# Altium project gtrack_tag_v2.PrjPcb (part 1 of 2)
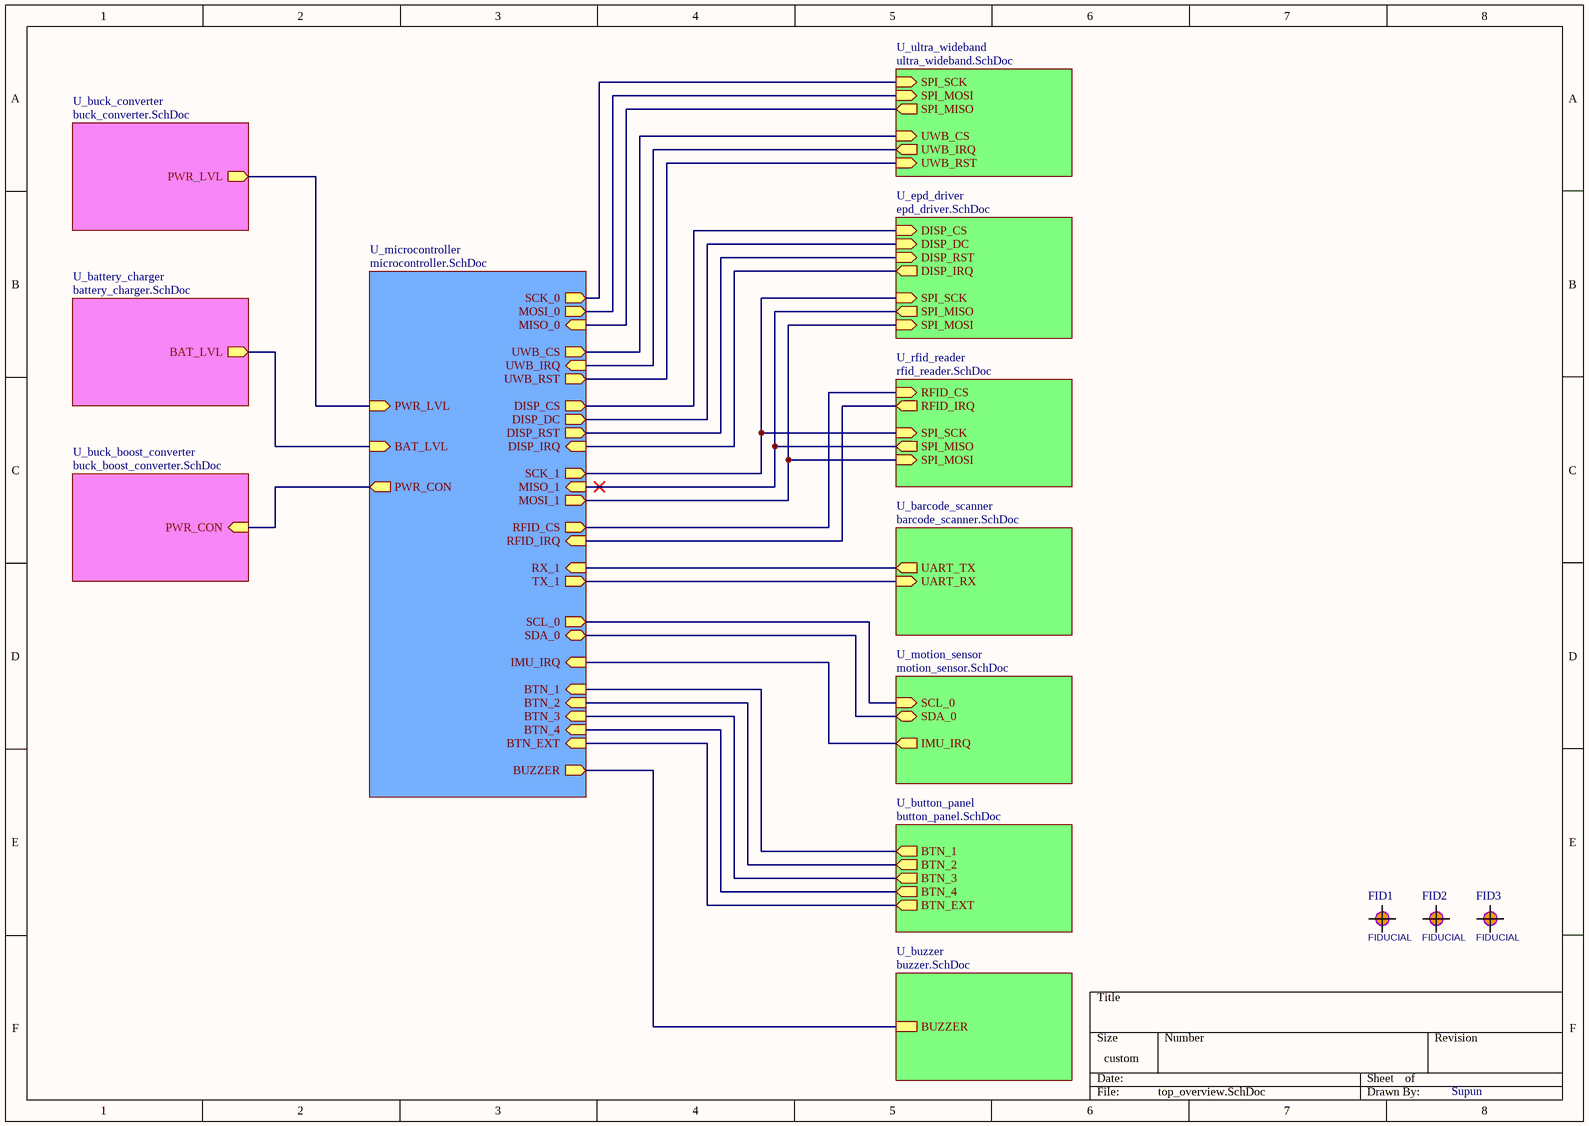
[diagram p0: top_overview.SchDoc]
12 sheets, 250 parts. Net scope: hierarchical (ports join the sheet entries above them; power ports are global).
Board file: GTrackTag_v2.PcbDoc
Sheets:
  top_overview.SchDoc
    U_battery_charger = battery_charger.SchDoc
    U_buck_boost_converter = buck_boost_converter.SchDoc
    U_microcontroller = microcontroller.SchDoc
    U_rfid_reader = rfid_reader.SchDoc
    U_ultra_wideband = ultra_wideband.SchDoc
    U_button_panel = button_panel.SchDoc
    U_barcode_scanner = barcode_scanner.SchDoc
    U_buzzer = buzzer.SchDoc
    U_epd_driver = epd_driver.SchDoc
    U_buck_converter = buck_converter.SchDoc
    U_motion_sensor = motion_sensor.SchDoc

## Sheet top_overview.SchDoc
size 297 x 209 mm; DrawnBy: Supun; Engineer: Supun; Organization: C3

### Parts
FID1  FIDUCIAL  [FIDUCIAL1SM2]  (no BOM)
FID2  FIDUCIAL  [FIDUCIAL1SM2]  (no BOM)
FID3  FIDUCIAL  [FIDUCIAL1SM2]  (no BOM)

### Sub-sheets
U_barcode_scanner = barcode_scanner.SchDoc: UART_TX (out), UART_RX (in)
U_battery_charger = battery_charger.SchDoc: BAT_LVL (out)
U_buck_boost_converter = buck_boost_converter.SchDoc: PWR_CON (in)
U_buck_converter = buck_converter.SchDoc: PWR_LVL (out)
U_button_panel = button_panel.SchDoc: BTN_EXT (out), BTN_2 (out), BTN_4 (out), BTN_1 (out), BTN_3 (out)
U_buzzer = buzzer.SchDoc: BUZZER
U_epd_driver = epd_driver.SchDoc: SPI_MISO (out), DISP_CS (in), DISP_DC (in), SPI_SCK (in), SPI_MOSI (in), DISP_IRQ (out), DISP_RST (in)
U_microcontroller = microcontroller.SchDoc: RFID_IRQ (in), DISP_DC (out), RFID_CS (out), DISP_CS (out), BUZZER (out), DISP_RST (out), MISO_1 (in), MOSI_1 (out), SCK_1 (out), MOSI_0 (out), UWB_CS (out), SCK_0 (out), UWB_IRQ (in), UWB_RST (out), MISO_0 (in), BTN_2 (in), RX_1 (in), BTN_1 (in), BTN_4 (in), TX_1 (out), BTN_3 (in), BTN_EXT (in), PWR_CON (out), BAT_LVL (in), SDA_0 (bidir), SCL_0 (out), DISP_IRQ (in), IMU_IRQ (in), PWR_LVL (in)
U_motion_sensor = motion_sensor.SchDoc: SCL_0 (in), IMU_IRQ (out), SDA_0 (bidir)
U_rfid_reader = rfid_reader.SchDoc: RFID_IRQ (out), SPI_SCK (in), SPI_MISO (out), RFID_CS (in), SPI_MOSI (in)
U_ultra_wideband = ultra_wideband.SchDoc: SPI_MISO (out), UWB_IRQ (out), UWB_RST (in), UWB_CS (in), SPI_SCK (in), SPI_MOSI (in)

### Nets
BAT_LVL: sheet U_battery_charger/BAT_LVL, sheet U_microcontroller/BAT_LVL
BTN_1: sheet U_microcontroller/BTN_1, sheet U_button_panel/BTN_1
BTN_2: sheet U_microcontroller/BTN_2, sheet U_button_panel/BTN_2
BTN_3: sheet U_microcontroller/BTN_3, sheet U_button_panel/BTN_3
BTN_4: sheet U_microcontroller/BTN_4, sheet U_button_panel/BTN_4
BTN_EXT: sheet U_microcontroller/BTN_EXT, sheet U_button_panel/BTN_EXT
BUZZER: sheet U_microcontroller/BUZZER, sheet U_buzzer/BUZZER
DISP_CS: sheet U_microcontroller/DISP_CS, sheet U_epd_driver/DISP_CS
DISP_DC: sheet U_microcontroller/DISP_DC, sheet U_epd_driver/DISP_DC
DISP_IRQ: sheet U_microcontroller/DISP_IRQ, sheet U_epd_driver/DISP_IRQ
IMU_IRQ: sheet U_microcontroller/IMU_IRQ, sheet U_motion_sensor/IMU_IRQ
MISO_0: sheet U_microcontroller/MISO_0, sheet U_ultra_wideband/SPI_MISO
MISO_1: sheet U_microcontroller/MISO_1, sheet U_rfid_reader/SPI_MISO, sheet U_epd_driver/SPI_MISO
MOSI_0: sheet U_microcontroller/MOSI_0, sheet U_ultra_wideband/SPI_MOSI
MOSI_1: sheet U_microcontroller/MOSI_1, sheet U_rfid_reader/SPI_MOSI, sheet U_epd_driver/SPI_MOSI
PWR_CON: sheet U_buck_boost_converter/PWR_CON, sheet U_microcontroller/PWR_CON
PWR_LVL: sheet U_microcontroller/PWR_LVL, sheet U_buck_converter/PWR_LVL
RFID_CS: sheet U_microcontroller/RFID_CS, sheet U_rfid_reader/RFID_CS
RFID_IRQ: sheet U_microcontroller/RFID_IRQ, sheet U_rfid_reader/RFID_IRQ
RST: sheet U_microcontroller/DISP_RST, sheet U_epd_driver/DISP_RST
RX_1: sheet U_microcontroller/RX_1, sheet U_barcode_scanner/UART_TX
SCK_0: sheet U_microcontroller/SCK_0, sheet U_ultra_wideband/SPI_SCK
SCK_1: sheet U_microcontroller/SCK_1, sheet U_rfid_reader/SPI_SCK, sheet U_epd_driver/SPI_SCK
SCL: sheet U_microcontroller/SCL_0, sheet U_motion_sensor/SCL_0
SDA: sheet U_microcontroller/SDA_0, sheet U_motion_sensor/SDA_0
TX_1: sheet U_microcontroller/TX_1, sheet U_barcode_scanner/UART_RX
UWB_CS: sheet U_microcontroller/UWB_CS, sheet U_ultra_wideband/UWB_CS
UWB_IRQ: sheet U_microcontroller/UWB_IRQ, sheet U_ultra_wideband/UWB_IRQ
UWB_RST: sheet U_microcontroller/UWB_RST, sheet U_ultra_wideband/UWB_RST

### Notes on the sheet
- Title
- Size:
- Date:
- A4
- Number:
- Time:
- Revision:
- Sheet
- of
- File:

### Library data of the parts
FID1-FID3 = Fiducial: FIDUCIAL PCB ASSEMBLY AUTOMATED SMT; MF: SAH; ASSEMBLY: DNP; VALUE: FIDUCIAL

## Sheet battery_charger.SchDoc
size 297 x 209 mm; DrawnBy: Supun; Engineer: Supun; Organization: C3
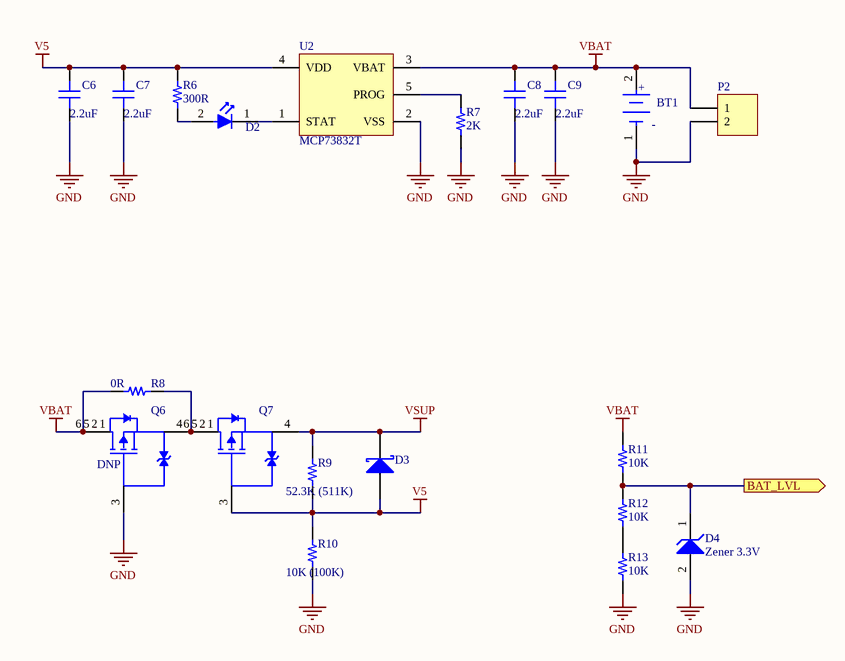
[diagram p1: battery_charger.SchDoc]

### Parts
BT1  18650_battery_holder  [Keystone_1043_0]  (value not drawn)
C6  2.2uF  [CAP 0603_1608]
C7  2.2uF  [CAP 0603_1608]
C8  2.2uF  [CAP 0603_1608]
C9  2.2uF  [CAP 0603_1608]
D2  Red  [Würth_Elektronik_0_MFG]  (value not drawn)
D3  *  [Rohm_TUMD2M_MFG]  (value not drawn)
D4  Zener 3.3V  [Diodes_SOD-123_0]
P2  DNP  [HDR1X2]  (value not drawn)
Q6  DNP  [Diodes_Inc._TSOT26_MFG]
Q7  P Mosfet  [Diodes_Inc._TSOT26_MFG]  (value not drawn)
R6  300R  [RES 0603_1608]
R7  2K  [RES 0603_1608]
R8  0R  [RES 0603_1608]
R9  52.3K (511K)  [RES 0603_1608]
R10  10K (100K)  [RES 0603_1608]
R11  10K  [RES 0603_1608]
R12  10K  [RES 0603_1608]
R13  10K  [RES 0603_1608]
U2  MCP73832T  [MICROCHIP SOT-23-5 OT]

### Ports
BAT_LVL (out)

### Nets
GND: BT1.1(C) C6.2 C7.2 C8.2 C9.2 D4.2(A) P2.2 Q6.3(G) R7.2 R10.2 R13.2 U2.2(VSS)
V5: C6.1 C7.1 D3.2(A) Q7.3(G) R6.2 R9.2 R10.1 U2.4(VDD)
VBAT: BT1.2(A) C8.1 C9.1 P2.1 Q6.1(D) Q6.2(D) Q6.5(D) Q6.6(D) R8.1 R11.1 U2.3(VBAT)
VSUP: D3.1(K) Q7.4(S) R9.1
BAT_LVL: D4.1(K) R11.2 R12.1 ; port BAT_LVL
NetD2_1: D2.1(C) U2.1(STAT)
NetD2_2: D2.2(A) R6.1
NetQ6_4: Q6.4(S) Q7.1(D) Q7.2(D) Q7.5(D) Q7.6(D) R8.2
NetR7_1: R7.1 U2.5(PROG)
NetR12_2: R12.2 R13.1

### Notes on the sheet
- Title
- Size:
- Date:
- A4
- Number:
- Time:
- Revision:
- Sheet
- of
- File:
- (in symbol 18650_battery_holder) +; -

### Library data of the parts
BT1 = 18650_battery_holder: Batt Holder 18650 1 Cell; MF: *; MP: *; Value: *
C6-C9 = Capacitor: SMT Capacitor; MF: Samsung; MP: CL10A225KP8NNNC; Value: 2.2uF; Link: https://www.mouser.com/ProductDetail/Samsung-Electro-Mechanics/CL10A225KP8NNNC?qs=hqM3L16%252Bxldb5UYUGQVB5Q%3D%3D
D2 = LED SMD: Led Diffused SMD; MF: LiteOn; MP: LTST-C190KRKT; Value: Red; Link: https://www.mouser.com/ProductDetail/Lite-On/LTST-C190KRKT?qs=kAD5fFa1n5VY3YYNWPC1Fg%3D%3D
D3 = Schottky Diode: Schottky Barrier Rectifier, 40 V Maximum DC Blocking Voltage, -65 to 125 degC, 2-Pin SMA Case, RoHS; MF: Toshiba; MP: CUHS20F30,H3F; ComponentLink1Description: Manufacturer URL; ComponentLink2Description: Datasheet; ComponentLink3URL: http://www.vishay.com/docs/88746/ss12.pdf; ComponentLink3Description: Package Specification; ComponentLink1URL: http://www.vishay.com/; ComponentLink2URL: http://www.vishay.com/docs/88746/ss12.pdf; Value: *; Link: https://www.mouser.com/ProductDetail/Toshiba/CUHS20F30H3F?qs=PqoDHHvF6497%2FIoWy79A3w%3D%3D
D4 = Zener Diode: Zener Voltage Regulator; Manufacturer: On Semiconductor; Packing: Tape and Reel; P Max (W): 0.5; VZ Typ (V): 4.7; MF: Onsemi; MP: MMSZ5226BT1G; ComponentLink1Description: Manufacturer URL; ComponentLink2Description: Datasheet; DatasheetVersion: Rev. 12; ComponentLink3URL: http://www.onsemi.com/pub_link/Collateral/425-04.PDF; ComponentLink3Description: Package Specification; ComponentLink1URL: http://www.onsemi.com/; ComponentLink2URL: http://www.onsemi.com/pub_link/Collateral/MMSZ5221BT1-D.PDF; PackageVersion: Rev. G, 10/2009; PackageReference: SOD-123-2-425-04; PackageDescription: 2-Pin SOD, Body 1.6 x 2.69 mm; Mounting Technology: Surface Mount; RoHS: Pb-Free; Value: Zener 3.3V; Link: https://www.mouser.com/ProductDetail/onsemi/MMSZ5226BT1G?qs=P4IOph%252Bbot%2Ft8yNxdh48XQ%3D%3D
P2 = Header 2: Header, 2-Pin; LatestRevisionDate: 17-Jul-2002; LatestRevisionNote: Re-released for DXP Platform.; Publisher: Altium Limited; Value: DNP; Link: https://
Q6 = Mosfet-P-6_ESD: P-Channel Enhancement Mode MOS Transistor, 3-Pin SOT23; MF: Vishay; MP: SI3421DV-T1-GE3; Value: P Mosfet; Link: https://www.mouser.com/ProductDetail/Vishay-Semiconductors/SI3421DV-T1-GE3?qs=dpt6vIvaxwjvmZPXyyVpRg%3D%3D
Q7 = Mosfet-P-6_ESD: P-Channel Enhancement Mode MOS Transistor, 3-Pin SOT23; MF: Vishay; MP: SI3421DV-T1-GE3; Value: P Mosfet; Link: https://www.mouser.com/ProductDetail/Vishay-Semiconductors/SI3421DV-T1-GE3?qs=dpt6vIvaxwjvmZPXyyVpRg%3D%3D
R6 = Resistor: SMT Resistor; MF: YAGEO; MP: AC0603FR-07300RL; Value: 300R; Link: https://www.mouser.com/ProductDetail/YAGEO/AC0603FR-07300RL?qs=yhV1fb9g%2FKYRCKndxB9juA%3D%3D
R7 = Resistor: SMT Resistor; MF: YAGEO; MP: AC0603FR-072KL; Value: 2K; Link: https://www.mouser.com/ProductDetail/YAGEO/AC0603FR-072KL?qs=ygRr%2FtkhtesLR2bjSRHyag%3D%3D
R8 = Resistor: SMT Resistor; MF: YAGEO; MP: AC0603FR-070RL; Value: 0R; Link: https://www.mouser.com/ProductDetail/YAGEO/AC0603FR-070RL?qs=UoPT7wUmgYIHE8YhvUntLg%3D%3D
R9 = Resistor: SMT Resistor; MF: YAGEO; MP: AC0603FR-0752K3L; Value: 52.3K; Link: https://www.mouser.com/ProductDetail/YAGEO/AC0603FR-0752K3L?qs=ygRr%2Ftkhtes52vQmIU4puQ%3D%3D
R10-R13 = Resistor: SMT Resistor; MF: YAGEO; MP: AC0603FR-0710KL; Value: 10K; Link: https://www.mouser.com/ProductDetail/YAGEO/AC0603FR-0710KL?qs=UoPT7wUmgYKz3zh0UDMA4Q%3D%3D
U2 = MCP73832T: Miniature Single-Cell, Fully Integrated Li-Ion, Li-Polymer Charge Management Controller, 4.2V, 5-Pin SOT-23, Industrial Temperature, Tape and Reel; PartNumber: MCP73832T-2DCI/OT; MF: Microchip; PackageDescription: 5-Lead Plastic Small Outline Transistor (OT) [SOT-23]; PackageVersion: revBB, Aug-2009; DatasheetVersion: revE, Sep-2008; Code_IPC: SOT23-5; PackageReference: SOT-23-OT5; MP: MCP73832T-2DCI/OT; Value: *; Link: https://www.mouser.com/ProductDetail/Microchip-Technology/MCP73832T-2DCI-OT?qs=yUQqVecv4quyMtCX903Btw%3D%3D

## Sheet buck_boost_converter.SchDoc
size 297 x 209 mm; DrawnBy: Supun; Engineer: Supun; Organization: C3
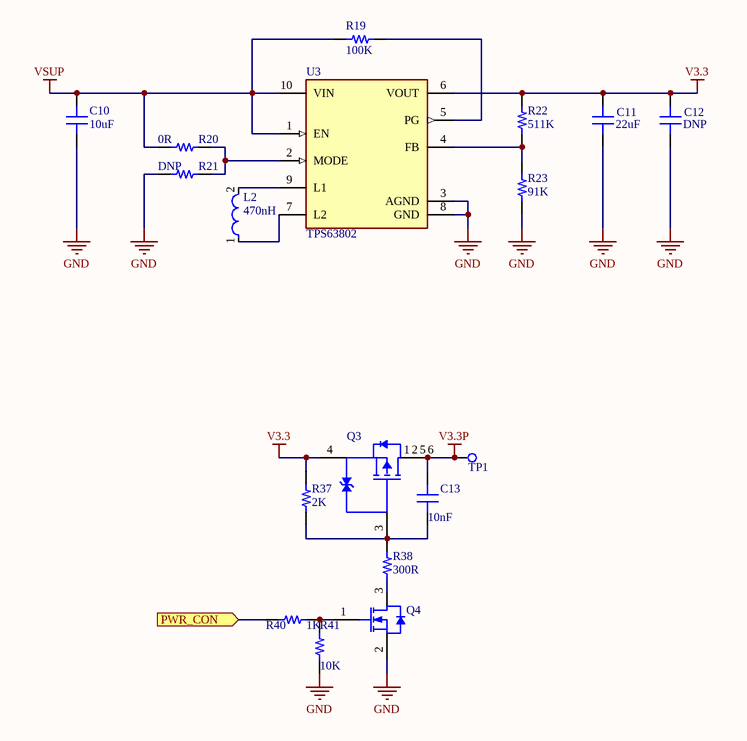
[diagram p2: buck_boost_converter.SchDoc]

### Parts
C10  10uF  [CAP 0603_1608]
C11  22uF  [CAP 0603_1608]
C12  DNP  [CAP 0603_1608]
C13  10nF  [CAP 0603_1608]
L2  470nH  [Coilcraft_XFL4015_MFG]
Q3  P Mosfet  [Diodes_Inc._TSOT26_MFG]  (value not drawn)
Q4  N Mosfet  [ON SEMI SOT-23-3]  (value not drawn)
R19  100K  [RES 0603_1608]
R20  0R  [RES 0603_1608]
R21  DNP  [RES 0603_1608]
R22  511K  [RES 0603_1608]
R23  91K  [RES 0603_1608]
R37  2K  [RES 0603_1608]
R38  300R  [RES 0603_1608]
R40  1K  [RES 0603_1608]
R41  10K  [RES 0603_1608]
TP1  Test Point  [TPSMD_S1]  (value not drawn)
U3  TPS63802  [Texas_Instruments_DLA0010A_MFG]

### Ports
PWR_CON (in)

### Nets
GND: C10.2 C11.2 C12.2 Q4.2(S) R21.1 R23.2 R41.1 U3.3(AGND) U3.8(GND)
V3.3: C11.1 C12.1 Q3.4(S) R22.1 R37.1 U3.6(VOUT)
V3.3P: C13.1 Q3.1(D) Q3.2(D) Q3.5(D) Q3.6(D) TP1.1(TP)
VSUP: C10.1 R19.1 R20.1 U3.1(EN) U3.10(VIN)
PWR_CON: R40.1 ; port PWR_CON
NetC13_2: C13.2 Q3.3(G) R37.2 R38.2
NetL2_1: L2.1 U3.7(L2)
NetL2_2: L2.2 U3.9(L1)
NetQ4_1: Q4.1(G) R40.2 R41.2
NetQ4_3: Q4.3(D) R38.1
NetR19_2: R19.2 U3.5(PG)
NetR20_2: R20.2 R21.2 U3.2(MODE)
NetR22_2: R22.2 R23.1 U3.4(FB)

### Notes on the sheet
- Title
- Size:
- Date:
- A4
- Number:
- Time:
- Revision:
- Sheet
- of
- File:

### Library data of the parts
C10 = Capacitor: SMT Capacitor; MF: Murata; MP: GRM188R61C106MAALD; Value: 10uF; Link: https://www.mouser.com/ProductDetail/Murata-Electronics/GRM188R61C106MAALD?qs=hNud%2FORuBR3LEOKZ4RJp9w%3D%3D
C11 C12 = Capacitor: SMT Capacitor; MF: Murata; MP: GRM188R61A226ME15D; Link: https://www.mouser.com/ProductDetail/Murata-Electronics/GRM188R61A226ME15D?qs=eeBpzGFlv%252B8DV%2FrilzyhAw%3D%3D
  C11: Value: 22uF
  C12: Value: DNP
C13 = Capacitor: SMT Capacitor; MF: Murata; MP: GRM1885C1E103JA01D; Value: 10nF; Link: https://www.mouser.com/ProductDetail/Murata-Electronics/GRM1885C1E103JA01D?qs=ui%252B2d9lVEI4mHR%2FJ9wCzmw%3D%3D
L2 = Inductor_sm: Fixed Inductors 2.2uH 20% High Temp AEC-Q200; MF: Coilcraft; MP: XFL4015-471MEC; Value: 470nH; Link: https://www.mouser.com/ProductDetail/Coilcraft/XFL4015-471MEC?qs=zCSbvcPd3pYzCOJSVbeMnw%3D%3D
Q3 = Mosfet-P-6_ESD: as Q7 on sheet battery_charger; Value: P Mosfet; Link: https://www.mouser.com/ProductDetail/Vishay-Semiconductors/SI3421DV-T1-GE3?qs=dpt6vIvaxwjvmZPXyyVpRg%3D%3D
Q4 = Mosfet-N: N-Channel Enhancement Mode MOS Transistor, 30 V, 0.85 A, 3-Pin SOT23, Tape and Reel; Coss [typ] (pF): 27; Ciss [typ] (pF): 83; Packing: Tape & Reel; ID [max] (A): 0.85; VDS [max] (V): 30; MF: Diodes; MP: DMN2053U-7; ComponentLink1Description: Manufacturer URL; ComponentLink2Description: Datasheet; ComponentLink3Description: Package Specification; ComponentLink3URL: http://www.nxp.com/documents/outline_drawing/sot023_po.pdf; ComponentLink1URL: http://www.nxp.com/; ComponentLink2URL: http://www.nxp.com/documents/data_sheet/BSH103.pdf; PackageReference: SOT23; Channel Type: N; Code_JEDEC: TO-236AB; Mounting Technology: Surface Mount; PackageDescription: 3-Pin Small Outline Transistor Package, Body 2.9 x 1.3 mm, Pitch 0.95 mm; PackageVersion: 06-03-16, 03/2006; Value: N Mosfet; Link: https://www.mouser.com/ProductDetail/Diodes-Incorporated/DMN2053U-7?qs=y6ZabgHbY%252BwZqQYPRB57iA%3D%3D
R19 = Resistor: SMT Resistor; MF: YAGEO; MP: AC0603FR-07100KL; Value: 100K; Link: https://www.mouser.com/ProductDetail/YAGEO/AC0603FR-07100KL?qs=UoPT7wUmgYKBKZ83mTH%252BSA%3D%3D
R20 R21 = Resistor: as R8 on sheet battery_charger; Link: https://www.mouser.com/ProductDetail/YAGEO/AC0603FR-070RL?qs=UoPT7wUmgYIHE8YhvUntLg%3D%3D
  R20: Value: 0R
  R21: Value: DNP
R22 = Resistor: SMT Resistor; MF: YAGEO; MP: AC0603FR-07511KL; Value: 511K; Link: https://www.mouser.com/ProductDetail/YAGEO/AC0603FR-07511KL?qs=sGAEpiMZZMvdGkrng054twVr7TWeaA0slq%2FUVYWFkhk%3D
R23 = Resistor: SMT Resistor; MF: YAGEO; MP: AC0603FR-0791KL; Value: 91K; Link: https://www.mouser.com/ProductDetail/YAGEO/AC0603FR-0791KL?qs=sGAEpiMZZMvdGkrng054t2uy2SOblyUPa6Z36%252BTPeHc%3D
R37 = Resistor: as R7 on sheet battery_charger; Value: 2K; Link: https://www.mouser.com/ProductDetail/YAGEO/AC0603FR-072KL?qs=ygRr%2FtkhtesLR2bjSRHyag%3D%3D
R38 = Resistor: as R6 on sheet battery_charger; Value: 300R; Link: https://www.mouser.com/ProductDetail/YAGEO/AC0603FR-07300RL?qs=yhV1fb9g%2FKYRCKndxB9juA%3D%3D
R40 = Resistor: SMT Resistor; MF: YAGEO; MP: AC0603FR-071KL; Value: 1K; Link: https://www.mouser.com/ProductDetail/YAGEO/AC0603FR-071KL?qs=UoPT7wUmgYJx4gI0q%252BcIRQ%3D%3D
R41 = Resistor: as R10 on sheet battery_charger; Value: 10K; Link: https://www.mouser.com/ProductDetail/YAGEO/AC0603FR-0710KL?qs=UoPT7wUmgYKz3zh0UDMA4Q%3D%3D
U3 = TPS63802: Switching Voltage Regulators 2-A, high-efficient, 11- uA quiescent current buck-boost converter in QFN/DFN package 10-VSON-HR -40 to 125; MF: Texas Instruments; MP: TPS63802DLAT; Value: *; Link: https://www.mouser.com/ProductDetail/Texas-Instruments/TPS63802DLAT?qs=9r4v7xj2LnmaSyyQsA%2FrUA%3D%3D
TP1 = Test Point: Link: https://

## Sheet microcontroller.SchDoc
size 297 x 209 mm; DrawnBy: Supun; Engineer: Supun; Organization: C3
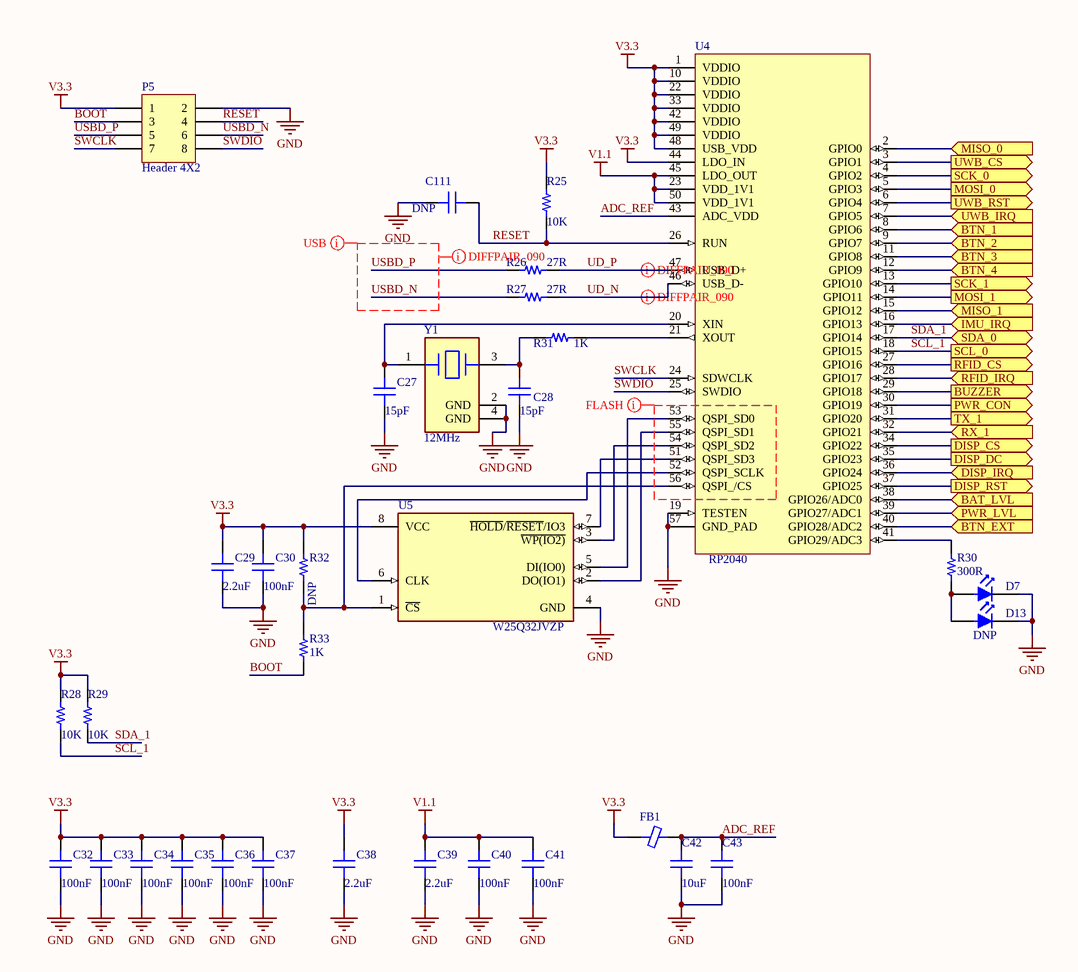
[diagram p3: microcontroller.SchDoc]

### Parts
C27  15pF  [CAP 0603_1608]
C28  15pF  [CAP 0603_1608]
C29  2.2uF  [CAP 0603_1608]
C30  100nF  [CAP 0603_1608]
C32  100nF  [CAP 0603_1608]
C33  100nF  [CAP 0603_1608]
C34  100nF  [CAP 0603_1608]
C35  100nF  [CAP 0603_1608]
C36  100nF  [CAP 0603_1608]
C37  100nF  [CAP 0603_1608]
C38  2.2uF  [CAP 0603_1608]
C39  2.2uF  [CAP 0603_1608]
C40  100nF  [CAP 0603_1608]
C41  100nF  [CAP 0603_1608]
C42  10uF  [CAP 0603_1608]
C43  100nF  [CAP 0603_1608]
C111  DNP  [CAP 0603_1608]
D7  Green  [Würth_Elektronik_0_MFG]  (value not drawn)
D13  DNP  [Würth_Elektronik_0_MFG]
FB1  Ferrite Beads  [Murata_BLM18-0_15-t0_8_MFG]  (value not drawn)
P5  Header 4X2  [HDR2X4]
R25  10K  [RES 0603_1608]
R26  27R  [RES 0603_1608]
R27  27R  [RES 0603_1608]
R28  10K  [RES 0603_1608]
R29  10K  [RES 0603_1608]
R30  300R  [RES 0603_1608]
R31  1K  [RES 0603_1608]
R32  DNP  [RES 0603_1608]
R33  1K  [RES 0603_1608]
U4  RP2040  [RP2040-Footprint-1]
U5  W25Q32JVZP  [WINBOND WSON-8 6x5mm]
Y1  12MHz  [ABRACON ABM8G]

### Ports
BAT_LVL (in), BTN_1 (in), BTN_2 (in), BTN_3 (in), BTN_4 (in), BTN_EXT (in), BUZZER (out), DISP_CS (out), DISP_DC (out), DISP_IRQ (in), DISP_RST (out), IMU_IRQ (in), MISO_0 (in), MISO_1 (in), MOSI_0 (out), MOSI_1 (out), PWR_CON (out), PWR_LVL (in), RFID_CS (out), RFID_IRQ (in), RX_1 (in), SCK_0 (out), SCK_1 (out), SCL_0 (out), SDA_0 (bidir), TX_1 (out), UWB_CS (out), UWB_IRQ (in), UWB_RST (out)

### Nets
GND: C27.1 C28.1 C29.2 C30.2 C32.2 C33.2 C34.2 C35.2 C36.2 C37.2 C38.2 C39.2 C40.2 C41.2 C42.2 C43.2 C111.1 D7.1(C) D13.1(C) P5.2 U4.19(TESTEN) U4.57(GND_PAD) U5.4(GND) Y1.2(GND) Y1.4(GND)
V1.1: C39.1 C40.1 C41.1 U4.23(VDD_1V1) U4.45(LDO_OUT) U4.50(VDD_1V1)
V3.3: C29.1 C30.1 C32.1 C33.1 C34.1 C35.1 C36.1 C37.1 C38.1 FB1.1 P5.1 R25.2 R28.2 R29.2 R32.1 U4.1(VDDIO) U4.10(VDDIO) U4.22(VDDIO) U4.33(VDDIO) U4.42(VDDIO) U4.44(LDO_IN) U4.48(USB_VDD) U4.49(VDDIO) U5.8(VCC)
ADC_REF: C42.1 C43.1 FB1.2 U4.43(ADC_VDD)
BAT_LVL: U4.38(GPIO26/ADC0) ; port BAT_LVL
BOOT: P5.3 R33.1
BTN_1: U4.8(GPIO6) ; port BTN_1
BTN_2: U4.9(GPIO7) ; port BTN_2
BTN_3: U4.11(GPIO8) ; port BTN_3
BTN_4: U4.12(GPIO9) ; port BTN_4
BTN_EXT: U4.40(GPIO28/ADC2) ; port BTN_EXT
BUZZER: U4.29(GPIO18) ; port BUZZER
DISP_CS: U4.34(GPIO22) ; port DISP_CS
DISP_DC: U4.35(GPIO23) ; port DISP_DC
DISP_IRQ: U4.36(GPIO24) ; port DISP_IRQ
IMU_IRQ: U4.16(GPIO13) ; port IMU_IRQ
MISO_0: U4.2(GPIO0) ; port MISO_0
MISO_1: U4.15(GPIO12) ; port MISO_1
MOSI_0: U4.5(GPIO3) ; port MOSI_0
MOSI_1: U4.14(GPIO11) ; port MOSI_1
PWR_CON: U4.30(GPIO19) ; port PWR_CON
PWR_LVL: U4.39(GPIO27/ADC1) ; port PWR_LVL
RESET: C111.2 P5.4 R25.1 U4.26(RUN)
RFID_CS: U4.27(GPIO16) ; port RFID_CS
RFID_IRQ: U4.28(GPIO17) ; port RFID_IRQ
RST: U4.37(GPIO25) ; port DISP_RST
RX_1: U4.32(GPIO21) ; port RX_1
SCK_0: U4.4(GPIO2) ; port SCK_0
SCK_1: U4.13(GPIO10) ; port SCK_1
SCL_1: R28.1 U4.18(GPIO15) ; port SCL_0  [project net SCL]
SDA_1: R29.1 U4.17(GPIO14) ; port SDA_0  [project net SDA]
SWCLK: P5.7 U4.24(SDWCLK)
SWDIO: P5.8 U4.25(SWDIO)
TX_1: U4.31(GPIO20) ; port TX_1
UD_N: R27.2 U4.46(USB_D-)
UD_P: R26.2 U4.47(USB_D+)
USBD_N: P5.6 R27.1
USBD_P: P5.5 R26.1
UWB_CS: U4.3(GPIO1) ; port UWB_CS
UWB_IRQ: U4.7(GPIO5) ; port UWB_IRQ
UWB_RST: U4.6(GPIO4) ; port UWB_RST
NetC27_2: C27.2 U4.20(XIN) Y1.1
NetC28_2: C28.2 R31.1 Y1.3
NetD7_2: D7.2(A) D13.2(A) R30.2
NetR30_1: R30.1 U4.41(GPIO29/ADC3)
NetR31_2: R31.2 U4.21(XOUT)
NetR32_2: R32.2 R33.2 U4.56(QSPI_/CS) U5.1(~{CS})
NetU4_51: U4.51(QSPI_SD3) U5.7(~{HOLD}/~{RESET}/IO3)
NetU4_52: U4.52(QSPI_SCLK) U5.6(CLK)
NetU4_53: U4.53(QSPI_SD0) U5.5(DI(IO0))
NetU4_54: U4.54(QSPI_SD2) U5.3(~{WP(IO2)})
NetU4_55: U4.55(QSPI_SD1) U5.2(DO(IO1))

### Layout directives
differential pair; differential pair class DIFF090: UD_N, UD_P, USBD_N, USBD_P
net class FLASH: (no net found under the mark)
net class USB: USBD_N, USBD_P

### Notes on the sheet
- Title
- Size:
- Date:
- A4
- Number:
- Time:
- Revision:
- Sheet
- of
- File:

### Library data of the parts
C27 C28 = Capacitor: SMT Capacitor; MF: Murata; MP: GRM1885C1H150JA01J; Value: 15pF; Link: https://www.mouser.com/ProductDetail/Murata-Electronics/GRM1885C1H150JA01J?qs=6X6%252BjuxzJaBd4%252Bvb3bD5Gw%3D%3D
C29 C38 C39 = Capacitor: as C6 on sheet battery_charger; Value: 2.2uF; Link: https://www.mouser.com/ProductDetail/Samsung-Electro-Mechanics/CL10A225KP8NNNC?qs=hqM3L16%252Bxldb5UYUGQVB5Q%3D%3D
C30 C32-C37 C40 C41 C43 = Capacitor: SMT Capacitor; MF: TDK; MP: CGA3E2X7R1E104K080AA; Value: 100nF; Link: https://www.mouser.com/ProductDetail/TDK/CGA3E2X7R1E104K080AA?qs=NRhsANhppD%2Fm7%2FOmmsm0vg%3D%3D
C42 = Capacitor: as C10 on sheet buck_boost_converter; Value: 10uF; Link: https://www.mouser.com/ProductDetail/Murata-Electronics/GRM188R61C106MAALD?qs=hNud%2FORuBR3LEOKZ4RJp9w%3D%3D
C111 = Capacitor: SMT Capacitor; MP: C0603C104K4PACTU; Value: DNP; Link: https://
D7 D13 = LED SMD: Led Diffused SMD; MF: LiteOn; MP: LTST-C190KGKT; Link: https://www.mouser.com/ProductDetail/Lite-On/LTST-C190KGKT?qs=205qCy6M2Q%252BAdcgwUZktqw%3D%3D
  D7: Value: Green
  D13: Value: DNP
FB1 = Ferrite Chip: SMT Ferrite Chip; MF: Murata; MP: BLM18PG471SN1D; Link: https://www.mouser.com/ProductDetail/Murata-Electronics/BLM18PG471SN1D?qs=EYzdjubb4S%2FN1Ip39GrHyg%3D%3D
P5 = Header 4X2: Header, 4-Pin, Dual row; LatestRevisionDate: 17-Jul-2002; LatestRevisionNote: Re-released for DXP Platform.; Publisher: Altium Limited
R25 R28 R29 = Resistor: as R10 on sheet battery_charger; Value: 10K; Link: https://www.mouser.com/ProductDetail/YAGEO/AC0603FR-0710KL?qs=UoPT7wUmgYKz3zh0UDMA4Q%3D%3D
R26 R27 = Resistor: SMT Resistor; MF: YAGEO; MP: AC0603FR-0727RL; Value: 27R; Link: https://www.mouser.com/ProductDetail/YAGEO/AC0603FR-0727RL?qs=yhV1fb9g%2FKZSwVP2Wqwqfg%3D%3D
R30 = Resistor: as R6 on sheet battery_charger; Value: 300R; Link: https://www.mouser.com/ProductDetail/YAGEO/AC0603FR-07300RL?qs=yhV1fb9g%2FKYRCKndxB9juA%3D%3D
R31 R33 = Resistor: as R40 on sheet buck_boost_converter; Value: 1K; Link: https://www.mouser.com/ProductDetail/YAGEO/AC0603FR-071KL?qs=UoPT7wUmgYJx4gI0q%252BcIRQ%3D%3D
R32 = Resistor: SMT Resistor; MF: *; MP: *; Value: DNP; Link: https://
U4 = RP2040: ARM® Cortex®-M0+ series Microcontroller IC 32-Bit Dual-Core 133MHz 16MB (16M x 8) FLASH 56-QFN (7x7); MF: Raspberry Pi; MP: RP2040TR13; Link: https://www.digikey.com/en/products/detail/raspberry-pi/SC0914-13/14306010
U5 = W25Q32JVZP: 3V 32M-BIT SERIAL FLASH MEMORY WITH DUAL, QUAD SPI; MF: Winbond; MP: W25Q32JVZPIQ; Value: *; Link: https://www.mouser.com/ProductDetail/Winbond/W25Q32JVZPIQ?qs=qSfuJ%252Bfl%2Fd5Ca0jgzBVqQA%3D%3D
Y1 = Crystal: Crystals AEC-Q200 CRYSTAL 4pin SMD; MF: ECS; MP: ECS-120-12-33-AGN-TR; Value: 12MHz; Link: https://www.mouser.com/ProductDetail/ECS/ECS-120-12-33-AGN-TR?qs=wd5RIQLrsJj7GY%252BaXCrd3A%3D%3D

## Sheet rfid_reader.SchDoc
size 297 x 209 mm; DrawnBy: Supun; Engineer: Supun; Organization: C3
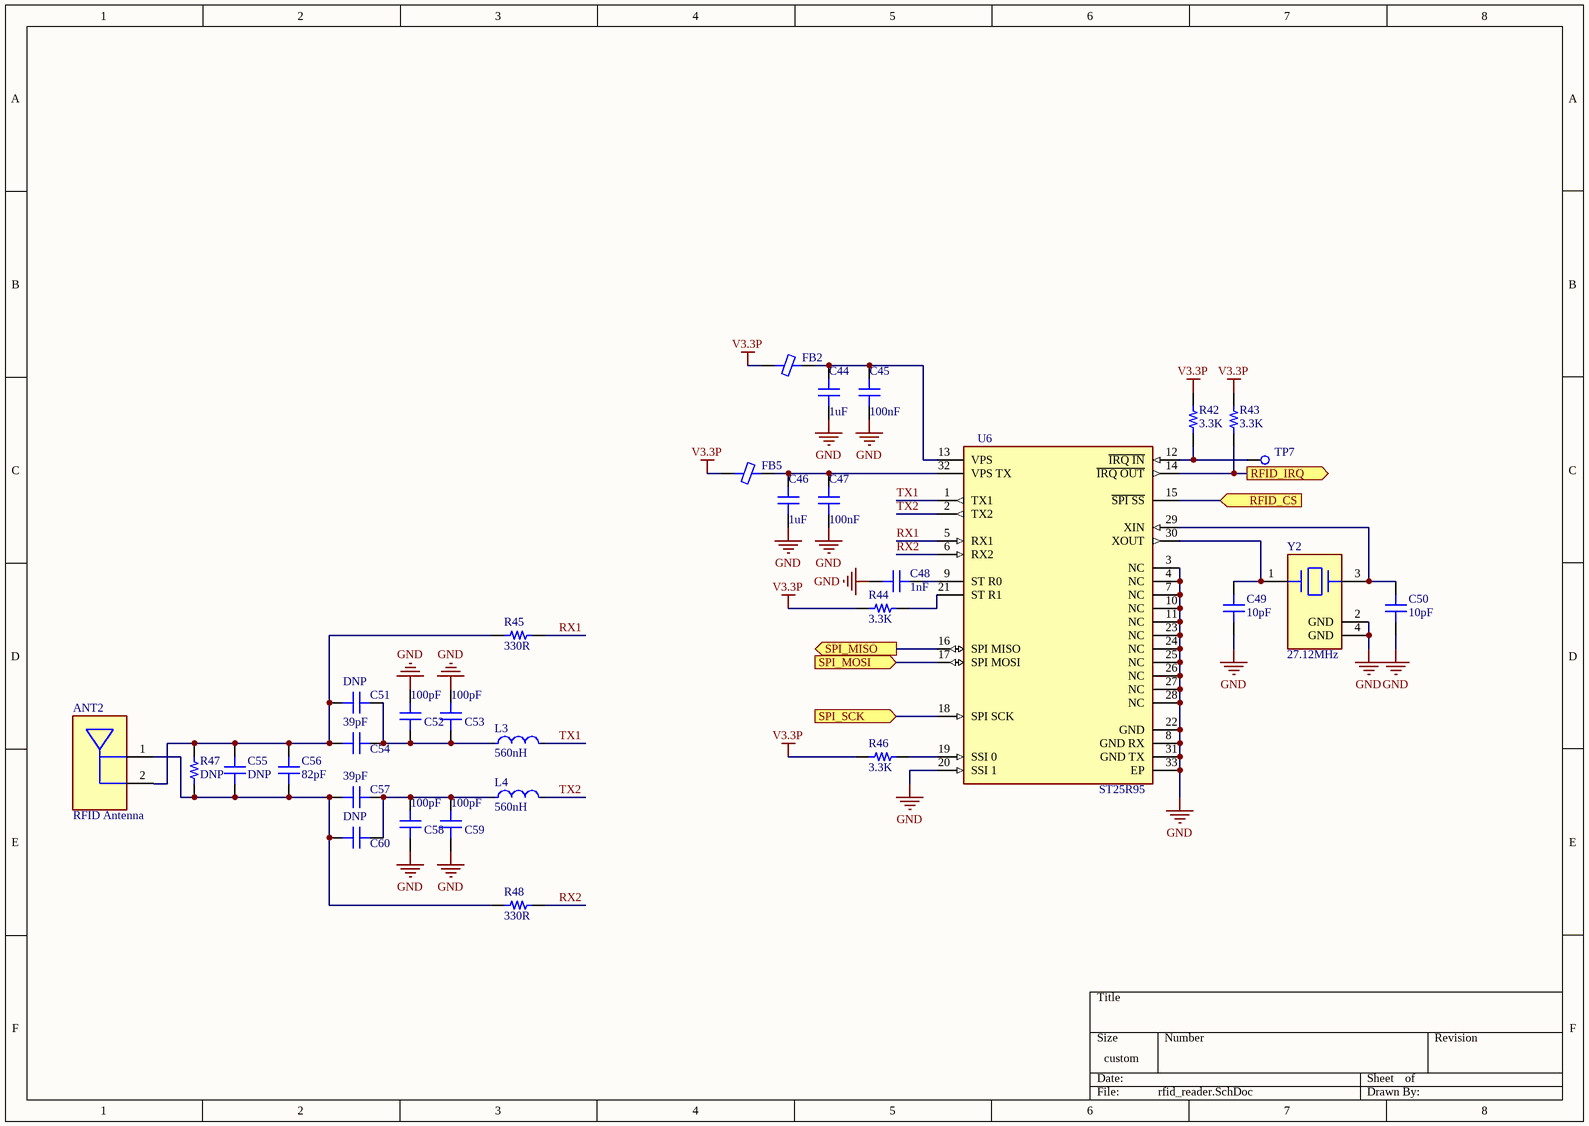
[diagram p4: rfid_reader.SchDoc]

### Parts
ANT2  RFID Antenna  [RFID_Antenna_3]
C44  1uF  [CAP 0603_1608]
C45  100nF  [CAP 0603_1608]
C46  1uF  [CAP 0603_1608]
C47  100nF  [CAP 0603_1608]
C48  1nF  [CAP 0603_1608]
C49  10pF  [CAP 0603_1608]
C50  10pF  [CAP 0603_1608]
C51  DNP  [CAP 0603_1608]
C52  100pF  [CAP 0603_1608]
C53  100pF  [CAP 0603_1608]
C54  39pF  [CAP 0603_1608]
C55  DNP  [CAP 0603_1608]
C56  82pF  [CAP 0603_1608]
C57  39pF  [CAP 0603_1608]
C58  100pF  [CAP 0603_1608]
C59  100pF  [CAP 0603_1608]
C60  DNP  [CAP 0603_1608]
FB2  (no value)  [Murata_BLM18-0_15-t0_8_MFG]
FB5  (no value)  [Murata_BLM18-0_15-t0_8_MFG]
L3  560nH  [IND 0806_2016]
L4  560nH  [IND 0806_2016]
R42  3.3K  [RES 0603_1608]
R43  3.3K  [RES 0603_1608]
R44  3.3K  [RES 0603_1608]
R45  330R  [RES 0603_1608]
R46  3.3K  [RES 0603_1608]
R47  DNP  [RES 0603_1608]
R48  330R  [RES 0603_1608]
TP7  Test Point  [TPSMD_S1]  (value not drawn)
U6  ST25R95  [STMicroelectronics_0_MFG]
Y2  27.12MHz  [ABRACON ABM8G]

### Ports
RFID_CS (in), RFID_IRQ (out), SPI_MISO (out), SPI_MOSI (in), SPI_SCK (in)

### Nets
GND: C44.1 C45.2 C46.1 C47.2 C48.1 C49.2 C50.2 C52.2 C53.2 C58.1 C59.1 U6.3(NC) U6.4(NC) U6.7(NC) U6.8(GND_RX) U6.10(NC) U6.11(NC) U6.20(SSI_1) U6.22(GND) U6.23(NC) U6.24(NC) U6.25(NC) U6.26(NC) U6.27(NC) U6.28(NC) U6.31(GND_TX) U6.33(EP) Y2.2(GND) Y2.4(GND)
V3.3P: FB2.1 FB5.1 R42.2 R43.2 R44.2 R46.2
MISO_1: U6.16(SPI_MISO) ; port SPI_MISO
MOSI_1: U6.17(SPI_MOSI) ; port SPI_MOSI
RFID_CS: U6.15(~{SPI_SS}) ; port RFID_CS
RFID_IRQ: R43.1 U6.14(~{IRQ_OUT}) ; port RFID_IRQ
RX1: R45.2 U6.5(RX1)
RX2: R48.2 U6.6(RX2)
SCK_1: U6.18(SPI_SCK) ; port SPI_SCK
TX1: L3.2 U6.1(TX1)
TX2: L4.2 U6.2(TX2)
NetANT2_1: ANT2.1 C55.1 C56.1 C57.2 C60.2 R47.1 R48.1
NetANT2_2: ANT2.2 C51.2 C54.2 C55.2 C56.2 R45.1 R47.2
NetC44_2: C44.2 C45.1 FB2.2 U6.13(VPS)
NetC46_2: C46.2 C47.1 FB5.2 U6.32(VPS_TX)
NetC48_2: C48.2 U6.9(ST_R0)
NetC49_1: C49.1 U6.30(XOUT) Y2.1
NetC50_1: C50.1 U6.29(XIN) Y2.3
NetC51_1: C51.1 C52.1 C53.1 C54.1 L3.1
NetC57_1: C57.1 C58.2 C59.2 C60.1 L4.1
NetR42_1: R42.1 TP7.1(TP) U6.12(~{IRQ_IN})
NetR44_1: R44.1 U6.21(ST_R1)
NetR46_1: R46.1 U6.19(SSI_0)

### Notes on the sheet
- Title
- Size:
- Date:
- A4
- Number:
- Time:
- Revision:
- Sheet
- of
- File:

### Library data of the parts
ANT2 = RFID PCB Antenna_2: 13.56MHz RFID Antenna 926.04 nH; MF: SAH; MP: *; Value: *
C44 C46 = Capacitor: SMT Capacitor; MF: Murata; MP: GRT188R61H105KE13D; Value: 1uF; Link: https://www.mouser.com/ProductDetail/Murata-Electronics/GRT188R61H105KE13D?qs=drgMNd%252BkGPNIxxtJByMGCg%3D%3D
C45 C47 = Capacitor: as C30 on sheet microcontroller; Value: 100nF; Link: https://www.mouser.com/ProductDetail/TDK/CGA3E2X7R1E104K080AA?qs=NRhsANhppD%2Fm7%2FOmmsm0vg%3D%3D
C48 = Capacitor: SMT Capacitor; MF: Murata; MP: GRM1885C1H102JA01D; Value: 1nF; Link: https://www.mouser.com/ProductDetail/Murata-Electronics/GRM1885C1H102JA01D?qs=H3lwsW1hsDtu9zD8AnV%2FOA%3D%3D
C49 C50 = Capacitor: SMT Capacitor; MF: Murata; MP: GRM1885C1H100GA01D; Value: 10pF; Link: https://www.mouser.com/ProductDetail/Murata-Electronics/GRM1885C1H100GA01D?qs=7Aw3Ng%2FBaE5snYvHxKANnw%3D%3D
C51 C54 C57 C60 = Capacitor: SMT Capacitor; MF: Murata; MP: GRM1885C1H390GA01J
  C51 C60: Value: DNP; Link: https://
  C54 C57: Value: 39pF; Link: https://www.mouser.com/ProductDetail/Murata-Electronics/GRM1885C1H390GA01J?qs=e4YKHiQKHyeNmbmJ2lwXdA%3D%3D
C52 C53 C58 C59 = Capacitor: SMT Capacitor; MF: Murata; MP: GRM1885C1H101GA01D; Value: 100pF; Link: https://www.mouser.com/ProductDetail/Murata-Electronics/GRM1885C1H101GA01D?qs=EsFwWZAkQ9fH40WPOVe8Rw%3D%3D
C55 = Capacitor: SMT Capacitor; MF: Murata; MP: GRM1885C1H560JA01J; Value: DNP; Link: https://
C56 = Capacitor: SMT Capacitor; MF: Murata; MP: GRM1885C1H820GA01D; Value: 82pF; Link: https://www.mouser.com/ProductDetail/Murata-Electronics/GRM1885C1H820GA01D?qs=wKgLNriqil4ECu1Lcc209g%3D%3D
FB2 FB5 = Ferrite Chip: SMT Ferrite Chip; MF: Murata Electronics; MP: BLM18RK601SN1D; Link: https://www.mouser.com/ProductDetail/Murata-Electronics/BLM18RK601SN1D?qs=y0QmqViQyZ9CJKFf5yPaOw%3D%3D
L3 L4 = Inductor_sm: Fixed Inductors 2.2uH 20% High Temp AEC-Q200; MF: Murata; MP: LQM21NNR56K10D; Value: 560nH; Link: https://www.mouser.com/ProductDetail/Murata-Electronics/LQM21NNR56K10D?qs=da47FVKfWTYye7WAouSyDQ%3D%3D
R42-R44 R46 = Resistor: SMT Resistor; MF: YAGEO; MP: AC0603FR-073K3L; Value: 3.3K; Link: https://www.mouser.com/ProductDetail/YAGEO/AC0603FR-073K3L?qs=yhV1fb9g%2FKZasQ4U0IUUCA%3D%3D
R45 R48 = Resistor: SMT Resistor; MF: YAGEO; MP: AC0603FR-07330RL; Value: 330R; Link: https://www.mouser.com/ProductDetail/YAGEO/AC0603FR-07330RL?qs=yhV1fb9g%2FKZrF%252BndswOPKw%3D%3D
R47 = Resistor: SMT Resistor; MF: Vishay; MP: CRCW06035R62FKEA; Value: DNP; Link: https://
U6 = ST25R95-VMD5T: RFID/NFC 13.56-MHz multi-protocol contactless transceiver IC; MF: STMicroelectronics; MP: ST25R95-VMD5T; Value: *; Link: https://www.mouser.com/ProductDetail/STMicroelectronics/ST25R95-VMD5T?qs=l7cgNqFNU1hwf5BC2e1e3A%3D%3D
Y2 = Crystal: Crystals AEC-Q200 CRYSTAL 4pin SMD; MF: ABRACON; MP: ABM8-27.120MHZ-10-D1G-T; Value: 27.12MHz; Link: https://www.mouser.com/ProductDetail/ABRACON/ABM8-27.120MHZ-10-D1G-T?qs=wnTfsH77Xs6%2FgBbo4S6Gaw%3D%3D
TP7 = Test Point: Link: https://

## Sheet ultra_wideband.SchDoc
size 297 x 209 mm; DrawnBy: Supun; Engineer: Supun; Organization: C3
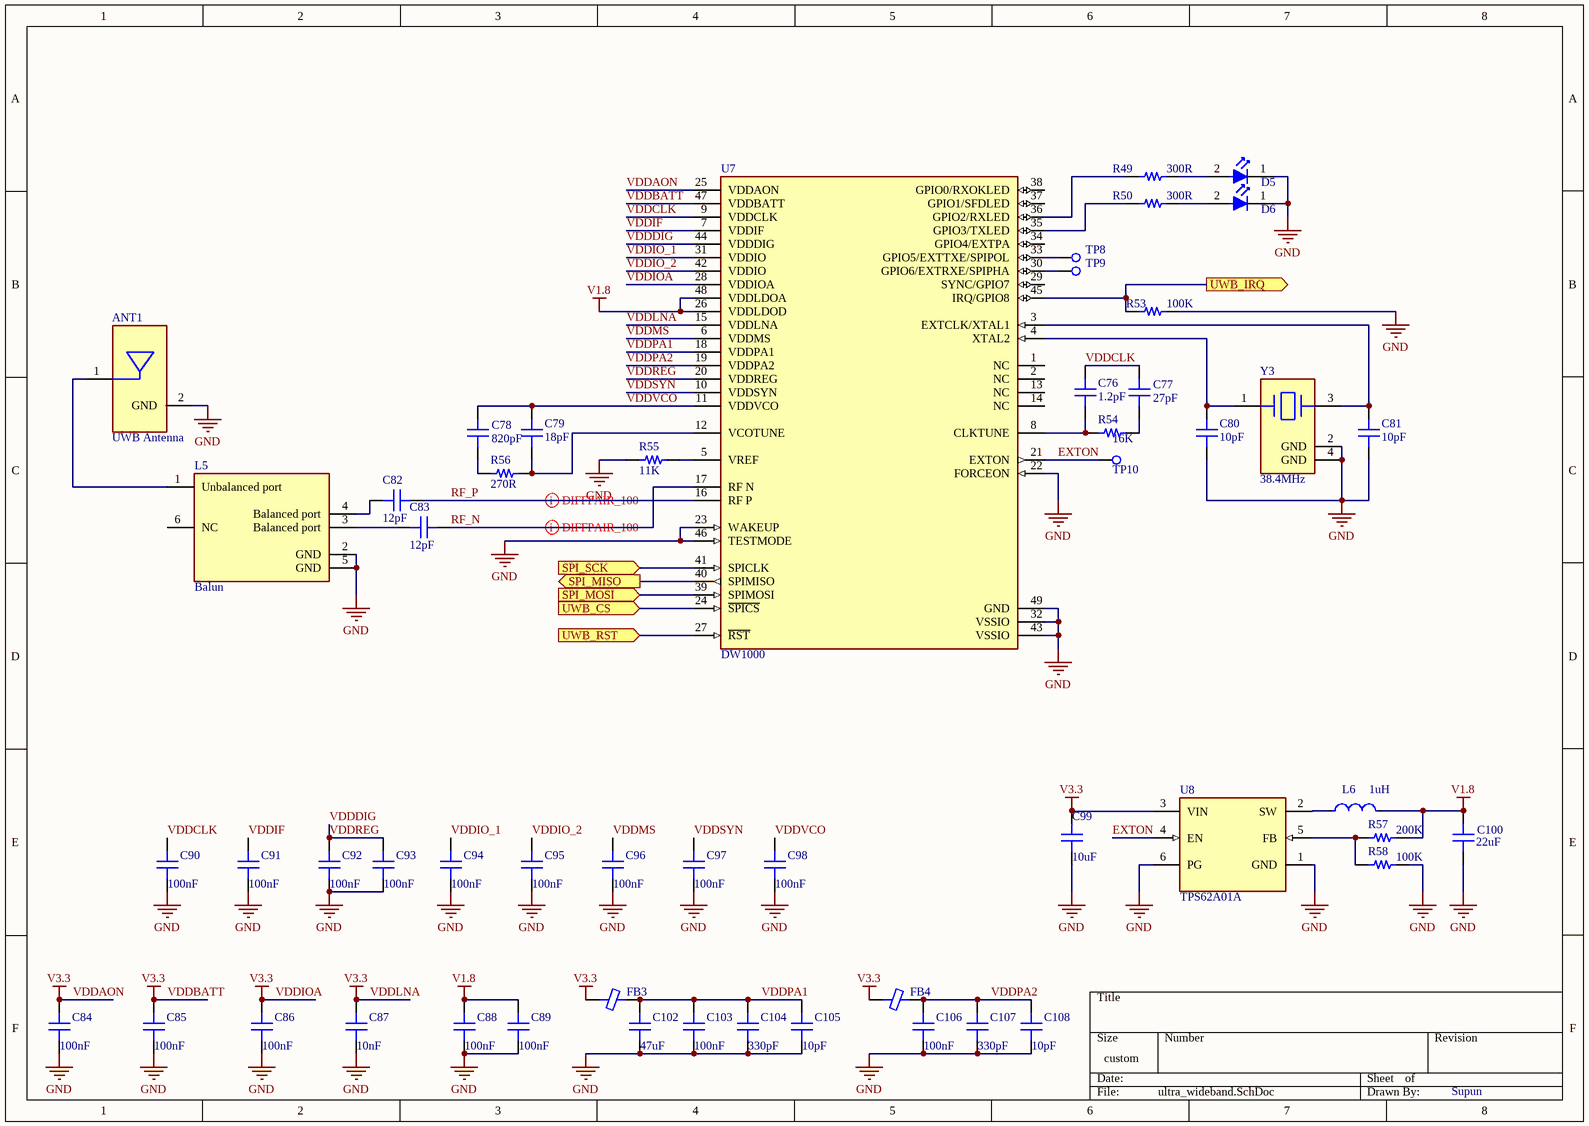
[diagram p5: ultra_wideband.SchDoc]

### Parts
ANT1  UWB Antenna  [UWB_ANTENNA_2]
C76  1.2pF  [CAP 0603_1608]
C77  27pF  [CAP 0603_1608]
C78  820pF  [CAP 0603_1608]
C79  18pF  [CAP 0603_1608]
C80  10pF  [CAP 0603_1608]
C81  10pF  [CAP 0603_1608]
C82  12pF  [CAP 0603_1608]
C83  12pF  [CAP 0603_1608]
C84  100nF  [CAP 0603_1608]
C85  100nF  [CAP 0603_1608]
C86  100nF  [CAP 0603_1608]
C87  10nF  [CAP 0603_1608]
C88  100nF  [CAP 0603_1608]
C89  100nF  [CAP 0603_1608]
C90  100nF  [CAP 0603_1608]
C91  100nF  [CAP 0603_1608]
C92  100nF  [CAP 0603_1608]
C93  100nF  [CAP 0603_1608]
C94  100nF  [CAP 0603_1608]
C95  100nF  [CAP 0603_1608]
C96  100nF  [CAP 0603_1608]
C97  100nF  [CAP 0603_1608]
C98  100nF  [CAP 0603_1608]
C99  10uF  [CAP 0603_1608]
C100  22uF  [CAP 0603_1608]
C102  47uF  [CAP 0603_1608]
C103  100nF  [CAP 0603_1608]
C104  330pF  [CAP 0603_1608]
C105  10pF  [CAP 0603_1608]
C106  100nF  [CAP 0603_1608]
C107  330pF  [CAP 0603_1608]
C108  10pF  [CAP 0603_1608]
D5  Green  [Würth_Elektronik_0_MFG]  (value not drawn)
D6  Red  [Würth_Elektronik_0_MFG]  (value not drawn)
FB3  Ferrite Beads  [Murata_BLM18-0_15-t0_8_MFG]  (value not drawn)
FB4  Ferrite Beads  [Murata_BLM18-0_15-t0_8_MFG]  (value not drawn)
L5  Balun  [TDK_HHM1595A1_MFG]
L6  1uH  [IND 1008_2520]
R49  300R  [RES 0603_1608]
R50  300R  [RES 0603_1608]
R53  100K  [RES 0603_1608]
R54  16K  [RES 0603_1608]
R55  11K  [RES 0603_1608]
R56  270R  [RES 0603_1608]
R57  200K  [RES 0603_1608]
R58  100K  [RES 0603_1608]
TP8  Test Point  [TPSMD_S1]  (value not drawn)
TP9  Test Point  [TPSMD_S1]  (value not drawn)
TP10  Test Point  [TPSMD_S1]  (value not drawn)
U7  DW1000  [Qorvo_1_IPC_B]
U8  TPS62A01A  [TI SOT-563 DRL]
Y3  38.4MHz  [ABRACON ABM8G]

### Ports
SPI_MISO (out), SPI_MOSI (in), SPI_SCK (in), UWB_CS (in), UWB_IRQ (out), UWB_RST (in)

### Nets
GND: ANT1.2(GND) C80.1 C81.1 C84.2 C85.2 C86.2 C87.2 C88.2 C89.2 C90.2 C91.2 C92.2 C93.2 C94.2 C95.2 C96.2 C97.2 C98.2 C99.2 C100.2 C102.1 C103.2 C104.1 C105.1 C106.2 C107.1 C108.1 D5.1(C) D6.1(C) L5.2(GND) L5.5(GND) R53.1 R55.1 R58.2 U7.22(FORCEON) U7.23(WAKEUP) U7.32(VSSIO) U7.43(VSSIO) U7.46(TESTMODE) U7.49(GND) U8.1(GND) U8.6(PG) Y3.2(GND) Y3.4(GND)
V1.8: C88.1 C89.1 C100.1 L6.2 R57.2 U7.26(VDDLDOD) U7.48(VDDLDOA)
V3.3: C84.1 C85.1 C86.1 C87.1 C99.1 FB3.1 FB4.1 U7.15(VDDLNA) U7.25(VDDAON) U7.28(VDDIOA) U7.47(VDDBATT) U8.3(VIN)  [also labelled VDDAON, VDDBATT, VDDIOA, VDDLNA]
EXTON: TP10.1(TP) U7.21(EXTON) U8.4(EN)
MISO_0: U7.40(SPIMISO) ; port SPI_MISO
MOSI_0: U7.39(SPIMOSI) ; port SPI_MOSI
RF_N: C83.1 U7.17(RF_N)
RF_P: C82.1 U7.16(RF_P)
SCK_0: U7.41(SPICLK) ; port SPI_SCK
UWB_CS: U7.24(~{SPICS}) ; port UWB_CS
UWB_IRQ: R53.2 U7.45(IRQ/GPIO8) ; port UWB_IRQ
UWB_RST: U7.27(~{RST}) ; port UWB_RST
VDDCLK: C76.2 C77.2 C90.1 U7.9(VDDCLK)
VDDDIG: C92.1 C93.1 U7.20(VDDREG) U7.44(VDDDIG)  [also labelled VDDREG]
VDDIF: C91.1 U7.7(VDDIF)
VDDIO_1: C94.1 U7.31(VDDIO)
VDDIO_2: C95.1 U7.42(VDDIO)
VDDMS: C96.1 U7.6(VDDMS)
VDDPA1: C102.2 C103.1 C104.2 C105.2 FB3.2 U7.18(VDDPA1)
VDDPA2: C106.1 C107.2 C108.2 FB4.2 U7.19(VDDPA2)
VDDSYN: C97.1 U7.10(VDDSYN)
VDDVCO: C78.2 C79.2 C98.1 U7.11(VDDVCO)
NetANT1_1: ANT1.1 L5.1(Unbalanced_port)
NetC76_1: C76.1 R54.2 U7.8(CLKTUNE)
NetC77_1: C77.1 R54.1
NetC78_1: C78.1 R56.2
NetC79_1: C79.1 R56.1 U7.12(VCOTUNE)
NetC80_2: C80.2 U7.4(XTAL2) Y3.1
NetC81_2: C81.2 U7.3(EXTCLK/XTAL1) Y3.3
NetC82_2: C82.2 L5.4(Balanced_port)
NetC83_2: C83.2 L5.3(Balanced_port)
NetD5_2: D5.2(A) R49.2
NetD6_2: D6.2(A) R50.2
NetL6_1: L6.1 U8.2(SW)
NetR49_1: R49.1 U7.36(GPIO2/RXLED)
NetR50_1: R50.1 U7.35(GPIO3/TXLED)
NetR55_2: R55.2 U7.5(VREF)
NetR57_1: R57.1 R58.1 U8.5(FB)
NetTP8_1: TP8.1(TP) U7.33(GPIO5/EXTTXE/SPIPOL)
NetTP9_1: TP9.1(TP) U7.30(GPIO6/EXTRXE/SPIPHA)

Not connected (* = marked no-connect by the designer): L5 6(NC); U7 1(NC) 2(NC) 13(NC) 14(NC) 29(SYNC/GPIO7) 34(GPIO4/EXTPA) 37(GPIO1/SFDLED) 38(GPIO0/RXOKLED)

### Layout directives
differential pair; differential pair class DIFF100: RF_N, RF_P

### Notes on the sheet
- Title
- Size:
- Date:
- A4
- Number:
- Time:
- Revision:
- Sheet
- of
- File:

### Library data of the parts
ANT1 = UWB PCB Antenna: PCB Antenna; MF: SAH; MP: *; Value: *
C76 = Capacitor: SMT Capacitor; MF: Murata; MP: GRM1885C1H1R2CA01D; Value: 1.2pF; Link: https://www.mouser.com/ProductDetail/Murata-Electronics/GRM1885C1H1R2CA01D?qs=9yYqngZLNofO2BzK0fMtoQ%3D%3D
C77 = Capacitor: SMT Capacitor; MF: Murata; MP: GRM1885C1H270JA01D; Value: 27pF; Link: https://www.mouser.com/ProductDetail/Murata-Electronics/GRM1885C1H270JA01D?qs=Mti35kkwCSM3XwxonqPhaQ%3D%3D
C78 = Capacitor: SMT Capacitor; MF: Murata; MP: GRM1885C1H821JA01D; Value: 820pF; Link: https://www.mouser.com/ProductDetail/Murata-Electronics/GRM1885C1H821JA01D?qs=2MiASeLb%252BOD2kFngltnvvA%3D%3D
C79 = Capacitor: SMT Capacitor; MF: Murata; MP: GRM1885C1H180JA01J; Value: 18pF; Link: https://www.mouser.com/ProductDetail/Murata-Electronics/GRM1885C1H180JA01J?qs=9Cj2FLRihcNL8A7ng%252BzQpQ%3D%3D
C80 C81 C105 C108 = Capacitor: as C49 on sheet rfid_reader; Value: 10pF
  C80 C81: Link: https://www.mouser.com/ProductDetail/Murata-Electronics/GRM1885C1H100GA01D?qs=7Aw3Ng%2FBaE5snYvHxKANnw%3D%3D
  C105 C108: Link: https://
C82 C83 = Capacitor: SMT Capacitor; MF: Murata; MP: GRM1885C1H120JA01J; Value: 12pF; Link: https://www.mouser.com/ProductDetail/Murata-Electronics/GRM1885C1H120JA01J?qs=6X6%252BjuxzJaDbS6LwzBiDtw%3D%3D
C84-C86 C88-C98 C103 C106 = Capacitor: as C30 on sheet microcontroller; Value: 100nF; Link: https://www.mouser.com/ProductDetail/TDK/CGA3E2X7R1E104K080AA?qs=NRhsANhppD%2Fm7%2FOmmsm0vg%3D%3D
C87 = Capacitor: as C13 on sheet buck_boost_converter; Value: 10nF; Link: https://www.mouser.com/ProductDetail/Murata-Electronics/GRM1885C1E103JA01D?qs=ui%252B2d9lVEI4mHR%2FJ9wCzmw%3D%3D
C99 = Capacitor: as C10 on sheet buck_boost_converter; Value: 10uF; Link: https://www.mouser.com/ProductDetail/Murata-Electronics/GRM188R61C106MAALD?qs=hNud%2FORuBR3LEOKZ4RJp9w%3D%3D
C100 = Capacitor: as C11 on sheet buck_boost_converter; Value: 22uF; Link: https://www.mouser.com/ProductDetail/Murata-Electronics/GRM188R61A226ME15D?qs=eeBpzGFlv%252B8DV%2FrilzyhAw%3D%3D
C102 = Capacitor: SMT Capacitor; MF: Murata; MP: GRM188R60J476ME15D; Value: 47uF; Link: https://www.mouser.com/ProductDetail/Murata-Electronics/GRM188R60J476ME15D?qs=AEetWsPH0It1A1GvJsMuyQ%3D%3D
C104 C107 = Capacitor: SMT Capacitor; MF: Murata; MP: GRM1885C1H331JA01D; Value: 330pF; Link: https://www.mouser.com/ProductDetail/Murata-Electronics/GRM1885C1H331JA01D?qs=DiwnqUvG%2FIUYCCwNVhuo3w%3D%3D
D5 = LED SMD: as D7 on sheet microcontroller; Value: Green; Link: https://www.mouser.com/ProductDetail/Lite-On/LTST-C190KGKT?qs=205qCy6M2Q%252BAdcgwUZktqw%3D%3D
D6 = LED SMD: as D2 on sheet battery_charger; Value: Red; Link: https://www.mouser.com/ProductDetail/Lite-On/LTST-C190KRKT?qs=kAD5fFa1n5VY3YYNWPC1Fg%3D%3D
FB3 FB4 = Ferrite Chip: SMT Ferrite Chip; MF: Murata; MP: BLM18AG601SH1D; Link: https://www.mouser.com/ProductDetail/Murata-Electronics/BLM18AG601SH1D?qs=L3QzcrVjv97OjVi99nCgnA%3D%3D
L5 = HHM1595A1: Signal Conditioning LTCC BALUN 3000-8000MHz; MF: TDK; MP: HHM1595A1; Value: Balun; Link: https://www.mouser.com/ProductDetail/TDK/HHM1595A1?qs=CQ%2FIPMfstfij2T2%252BDRqDhg%3D%3D
L6 = Inductor_sm: Fixed Inductors 2.2uH 20% High Temp AEC-Q200; MF: Murata; MP: DFE252012F-1R0M=P2; Value: 1uH; Link: https://www.mouser.com/ProductDetail/Murata-Electronics/DFE252012F-1R0M%3dP2?qs=ty6qhqyUUEtPvXJAIo0Pnw%3D%3D
R49 R50 = Resistor: as R6 on sheet battery_charger; Value: 300R; Link: https://www.mouser.com/ProductDetail/YAGEO/AC0603FR-07300RL?qs=yhV1fb9g%2FKYRCKndxB9juA%3D%3D
R53 R58 = Resistor: as R19 on sheet buck_boost_converter; Value: 100K; Link: https://www.mouser.com/ProductDetail/YAGEO/AC0603FR-07100KL?qs=UoPT7wUmgYKBKZ83mTH%252BSA%3D%3D
R54 = Resistor: SMT Resistor; MF: YAGEO; MP: AC0603FR-0716KL; Value: 16K; Link: https://www.mouser.com/ProductDetail/YAGEO/AC0603FR-0716KL?qs=yhV1fb9g%2FKbveWp4BLOPMQ%3D%3D
R55 = Resistor: SMT Resistor; MF: YAGEO; MP: AC0603FR-0711KL; Value: 11K; Link: https://www.mouser.com/ProductDetail/YAGEO/AC0603FR-0711KL?qs=yhV1fb9g%2FKb4ptOMRzX2uQ%3D%3D
R56 = Resistor: SMT Resistor; MF: YAGEO; MP: AC0603FR-07270RL; Value: 270R; Link: https://www.mouser.com/ProductDetail/YAGEO/AC0603FR-07270RL?qs=yhV1fb9g%2FKYFLWtESjiWpg%3D%3D
R57 = Resistor: SMT Resistor; MF: YAGEO; MP: AC0603FR-07200KL; Value: 200K; Link: https://www.mouser.com/ProductDetail/YAGEO/AC0603FR-07200KL?qs=sGAEpiMZZMvdGkrng054t2uy2SOblyUPuZUSlNzrwrw%3D
U7 = DW1000: Fully integrated Ultra Wideband (UWB) transceiver IC, IEEE802.15.4-2011, 2-way ranging or TDoA, up to 6.8 Mbps; MF: Qorvo; MP: DW1000-I-TR13; Parameter 1: *; Link: https://www.mouser.com/ProductDetail/Qorvo/DW1000-I-TR13?qs=TiOZkKH1s2SHqHtNDSAfuQ%3D%3D
U8 = TPS62A01A: Switching Voltage Regulators 2.5-V to 5.5-V input, 1-A high-efficiency step-down converter with forced PWM in SOT-563 package; MF: Texas Instruments; MP: TPS62A01ADRLR; Link: https://www.mouser.com/ProductDetail/Texas-Instruments/TPS62A01ADRLR?qs=tlsG%2FOw5FFjxQ1CGo801Kw%3D%3D
Y3 = Crystal: Crystals AEC-Q200 CRYSTAL 4pin SMD; MF: ECS; MP: ECS-384-10-33B-CKY-TR; Value: 38.4MHz; Link: https://www.mouser.com/ProductDetail/ECS/ECS-384-10-33B-CKY-TR?qs=wd5RIQLrsJh9q4Mm6EsgEw%3D%3D
TP8-TP10 = Test Point: Link: https://

## Sheet button_panel.SchDoc
size 297 x 209 mm; DrawnBy: Supun; Engineer: Supun; Organization: C3
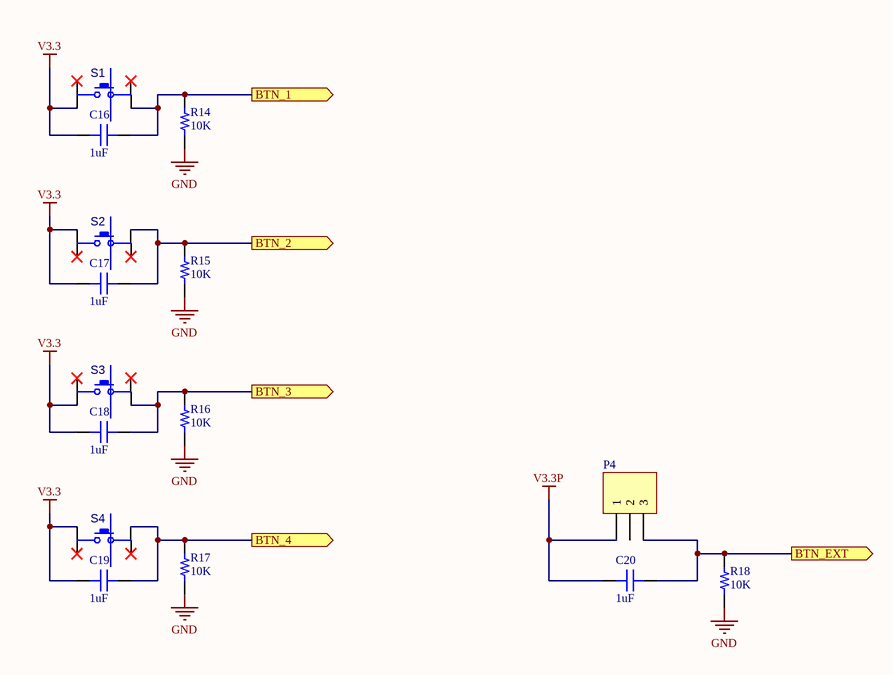
[diagram p6: button_panel.SchDoc]

### Parts
C16  1uF  [CAP 0603_1608]
C17  1uF  [CAP 0603_1608]
C18  1uF  [CAP 0603_1608]
C19  1uF  [CAP 0603_1608]
C20  1uF  [CAP 0603_1608]
P4  (no value)  [TEConn_EP2.5_1x3]
R14  10K  [RES 0603_1608]
R15  10K  [RES 0603_1608]
R16  10K  [RES 0603_1608]
R17  10K  [RES 0603_1608]
R18  10K  [RES 0603_1608]
S1  SPST-NO  [C&K PTS125 H7.3]  (value not drawn)
S2  SPST-NO  [C&K PTS125 H7.3]  (value not drawn)
S3  SPST-NO  [C&K PTS125 H7.3]  (value not drawn)
S4  SPST-NO  [C&K PTS125 H7.3]  (value not drawn)

### Ports
BTN_1 (out), BTN_2 (out), BTN_3 (out), BTN_4 (out), BTN_EXT (out)

### Nets
GND: R14.2 R15.2 R16.2 R17.2 R18.2
V3.3: C16.2 C17.2 C18.2 C19.2 S1.2(P3) S2.1(P1) S3.2(P3) S4.1(P1)
V3.3P: C20.2 P4.1
BTN_1: C16.1 R14.1 S1.4(P2) ; port BTN_1
BTN_2: C17.1 R15.1 S2.3(P4) ; port BTN_2
BTN_3: C18.1 R16.1 S3.4(P2) ; port BTN_3
BTN_4: C19.1 R17.1 S4.3(P4) ; port BTN_4
BTN_EXT: C20.1 P4.3 R18.1 ; port BTN_EXT

Not connected (* = marked no-connect by the designer): P4 2; S1 1(P1)* 3(P4)*; S2 2(P3)* 4(P2)*; S3 1(P1)* 3(P4)*; S4 2(P3)* 4(P2)*

### Notes on the sheet
- Title
- Size:
- Date:
- A4
- Number:
- Time:
- Revision:
- Sheet
- of
- File:

### Library data of the parts
C16-C20 = Capacitor: as C44 on sheet rfid_reader; Value: 1uF; Link: https://www.mouser.com/ProductDetail/Murata-Electronics/GRT188R61H105KE13D?qs=drgMNd%252BkGPNIxxtJByMGCg%3D%3D
P4 = Header 3H: Header, 3-Pin, Right Angle; MF: TE Connectivity; MP: 1744426-3; LatestRevisionDate: 17-Jul-2002; LatestRevisionNote: Re-released for DXP Platform.; Publisher: Altium Limited; Link: https://www.mouser.com/ProductDetail/TE-Connectivity-AMP/1744426-3?qs=IGPQaF7TU6sEhFWrzjofqw%3D%3D
R14-R18 = Resistor: as R10 on sheet battery_charger; Value: 10K; Link: https://www.mouser.com/ProductDetail/YAGEO/AC0603FR-0710KL?qs=UoPT7wUmgYKz3zh0UDMA4Q%3D%3D
S1-S4 = SPST-NO 4 PIN ALT1: SWITCH, PUSH BUTTON, TACTILE, SMD, SPDT, 6X6X7mm; MF: C&K; DESC: DESCRIPTION; MP: PTS125SJM73SMTR2LFS; Value: SPST-NO; ASSEMBLY: ASSEMBLY; PRICE: PRICE; Link: https://www.mouser.com/ProductDetail/CK/PTS125SJM73SMTR2LFS?qs=IL6XaBr%252B7X%252BXH%2FUFAqS8WQ%3D%3D

## Sheet barcode_scanner.SchDoc
size 297 x 209 mm; DrawnBy: Supun; Engineer: Supun; Organization: C3
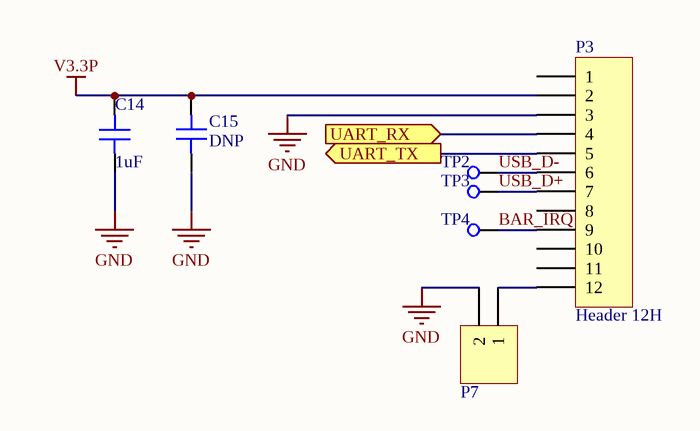
[diagram p7: barcode_scanner.SchDoc]

### Parts
C14  1uF  [CAP 0603_1608]
C15  DNP  [CAP 0603_1608]
P3  Header 12H  [Amphenol_FFC/FPC_12_0.5mm]
P7  DNP  [HDR1X2]  (value not drawn)
TP2  Test Point  [TPSMD_S1]  (value not drawn)
TP3  Test Point  [TPSMD_S1]  (value not drawn)
TP4  Test Point  [TPSMD_S1]  (value not drawn)

### Ports
UART_RX (in), UART_TX (out)

### Nets
GND: C14.1 C15.2 P3.3 P7.2
V3.3P: C14.2 C15.1 P3.2
BAR_IRQ: P3.9 TP4.1(TP)
RX_1: P3.5 ; port UART_TX
TX_1: P3.4 ; port UART_RX
USB_D+: P3.7 TP3.1(TP)
USB_D-: P3.6 TP2.1(TP)
NetP3_12: P3.12 P7.1

Not connected (* = marked no-connect by the designer): P3 1 8 10 11

### Notes on the sheet
- Title
- Size:
- Date:
- A4
- Number:
- Time:
- Revision:
- Sheet
- of
- File:

### Library data of the parts
C14 = Capacitor: as C44 on sheet rfid_reader; Value: 1uF; Link: https://www.mouser.com/ProductDetail/Murata-Electronics/GRT188R61H105KE13D?qs=drgMNd%252BkGPNIxxtJByMGCg%3D%3D
C15 = Capacitor: SMT Capacitor; Value: DNP; Link: https://
P3 = Header 12H: Header, 12-Pin, Right Angle; MF: Amphenol; MP: 10051922-1210ELF; LatestRevisionDate: 17-Jul-2002; LatestRevisionNote: Re-released for DXP Platform.; Publisher: Altium Limited; Value: *
P7 = Header 2: Header, 2-Pin; LatestRevisionDate: 17-Jul-2002; LatestRevisionNote: Re-released for DXP Platform.; Publisher: Altium Limited; Value: DNP
TP2-TP4 = Test Point: Link: https://

## Sheet buzzer.SchDoc
size 297 x 209 mm; DrawnBy: Supun; Engineer: Supun; Organization: C3
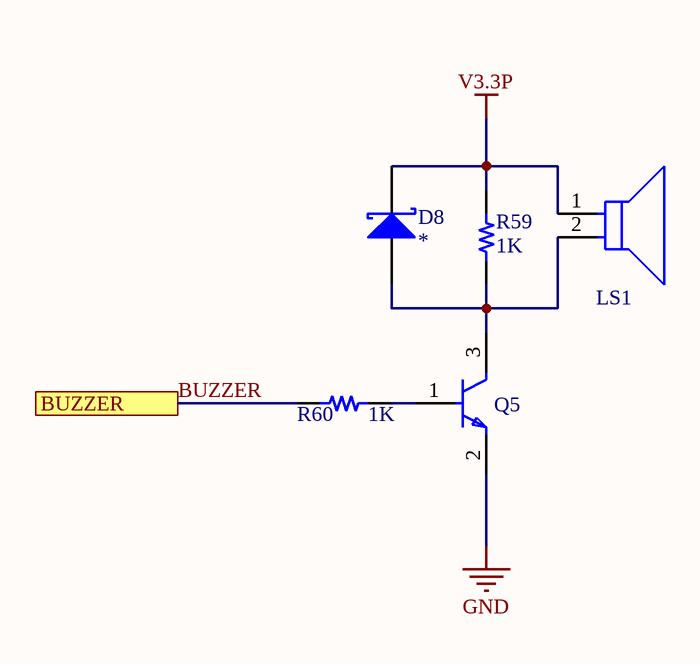
[diagram p8: buzzer.SchDoc]

### Parts
D8  *  [Rohm_TUMD2M_MFG]
LS1  Buzzer  [Murata_0_MFG]  (value not drawn)
Q5  N Transistor  [ON_Semiconductor_MA03D_MFG]  (value not drawn)
R59  1K  [RES 0603_1608]
R60  1K  [RES 0603_1608]

### Ports
BUZZER

### Nets
GND: Q5.2(E)
V3.3P: D8.1(K) LS1.1 R59.2
BUZZER: R60.1 ; port BUZZER
NetD8_2: D8.2(A) LS1.2 Q5.3(C) R59.1
NetQ5_1: Q5.1(B) R60.2

### Notes on the sheet
- Title
- Size:
- Date:
- A4
- Number:
- Time:
- Revision:
- Sheet
- of
- File:

### Library data of the parts
D8 = Schottky Diode: as D3 on sheet battery_charger; ComponentLink1Description: Manufacturer URL; ComponentLink2Description: Datasheet; ComponentLink3URL: http://www.vishay.com/docs/88746/ss12.pdf; ComponentLink3Description: Package Specification; ComponentLink1URL: http://www.vishay.com/; ComponentLink2URL: http://www.vishay.com/docs/88746/ss12.pdf; Value: *; Link: https://www.mouser.com/ProductDetail/Toshiba/CUHS20F30H3F?qs=PqoDHHvF6497%2FIoWy79A3w%3D%3D
LS1 = Piezo Buzzers: SPEAK AUDIO PIEZO TRANSDUCER 30V TH; MP: PS1240P02BT; MF: TDK; Voltage - Rated: 3V; Frequency: 4kHz; helpURL: https://upverter.com/upn/revision/4162df88e1b3dc74/; ComponentLink2Description: Datasheet; Temperature: -10°C to +70°C; Package: THT_12.2x6.5mm; Supplier 2: Mouser; Price: 0.40357881271; Supplier 1: Digi-Key; ComponentLink1URL: https://upverter.com/upn/revision/4162df88e1b3dc74/; Supplier Part Number 2: 810-PS1240P02BT; Supplier Part Number 1: 445-2525-1-ND; ComponentLink1Description: Upverter; ComponentLink2URL: https://upverter.com/datasheet/1aedf42020f7a0ec4f8097831a18cda881c6a5a0.pdf; RoHS: TRUE; Mouser Part Number: 810-PS1240P02BT; Voltage Range: 30V; Temperature Range High: +70°C; Digikey Description: SPEAK AUDIO PIEZO TRANSDUCER 30V TH; Digikey Part Number: 445-2525-1-ND; Lead Free: yes; Temperature Range Low: -10°C; Value: *; Link: https://www.mouser.com/ProductDetail/TDK/PS1240P02BT?qs=d7g9p1yFhWaZXSY9MjKMkw%3D%3D
Q5 = NPN: Small Signal Transistor, Bipolar (BJT), Single, NPN; MF: Nexperia; MP: MMBT3904,215; Value: N Transistor; Link: https://www.mouser.com/ProductDetail/Nexperia/MMBT3904215?qs=LOCUfHb8d9s%2FW6hzAJGDbw%3D%3D
R59 R60 = Resistor: as R40 on sheet buck_boost_converter; Value: 1K; Link: https://www.mouser.com/ProductDetail/YAGEO/AC0603FR-071KL?qs=UoPT7wUmgYJx4gI0q%252BcIRQ%3D%3D

## Sheet epd_driver.SchDoc
size 297 x 209 mm; DrawnBy: Supun; Engineer: Supun; Organization: C3
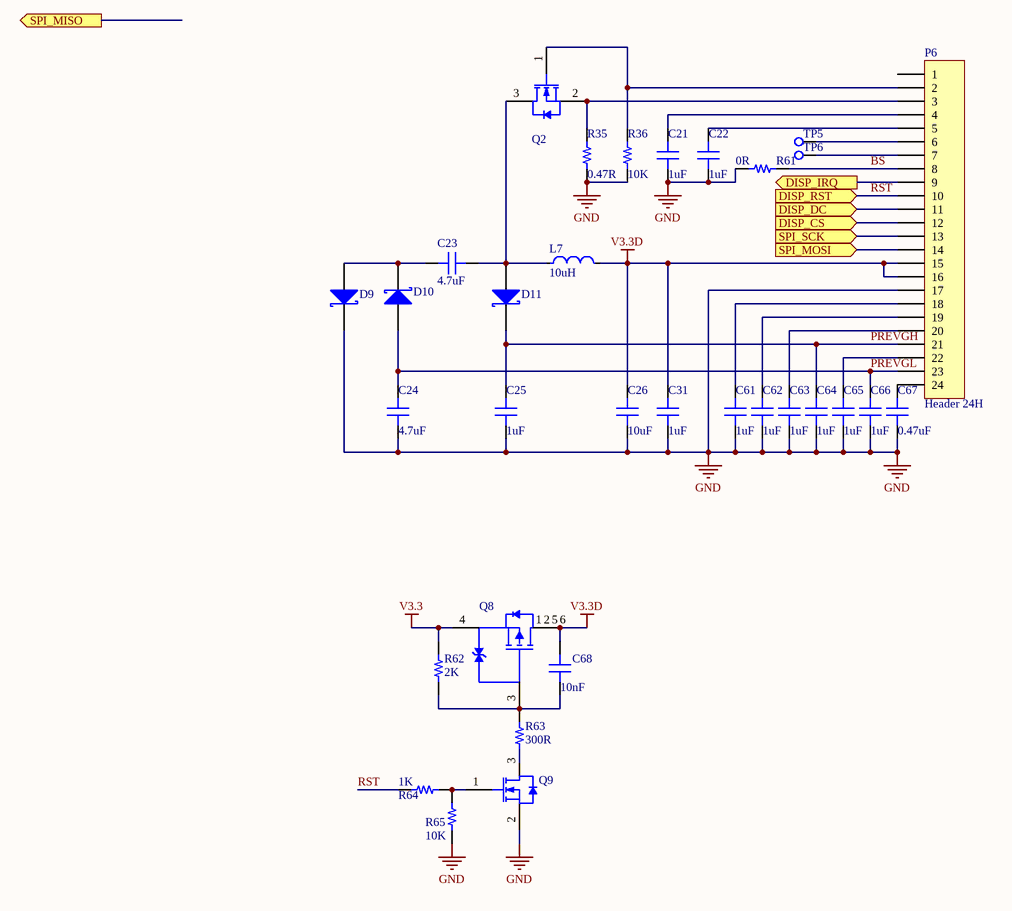
[diagram p9: epd_driver.SchDoc]

### Parts
C21  1uF  [CAP 0603_1608]
C22  1uF  [CAP 0603_1608]
C23  4.7uF  [CAP 0603_1608]
C24  4.7uF  [CAP 0603_1608]
C25  1uF  [CAP 0603_1608]
C26  10uF  [CAP 0603_1608]
C31  1uF  [CAP 0603_1608]
C61  1uF  [CAP 0603_1608]
C62  1uF  [CAP 0603_1608]
C63  1uF  [CAP 0603_1608]
C64  1uF  [CAP 0603_1608]
C65  1uF  [CAP 0603_1608]
C66  1uF  [CAP 0603_1608]
C67  0.47uF  [CAP 0603_1608]
C68  10nF  [CAP 0603_1608]
D9  *  [Rohm_TUMD2M_MFG]  (value not drawn)
D10  *  [Rohm_TUMD2M_MFG]  (value not drawn)
D11  *  [Rohm_TUMD2M_MFG]  (value not drawn)
L7  10uH  [IND 1008_2520]
P6  Header 24H  [Amphenol_FFC/FPC_24_0.5mm]
Q2  N Mosfet  [ON SEMI SOT-23-3]  (value not drawn)
Q8  P Mosfet  [Diodes_Inc._TSOT26_MFG]  (value not drawn)
Q9  N Mosfet  [ON SEMI SOT-23-3]  (value not drawn)
R35  0.47R  [RES 0603_1608]
R36  10K  [RES 0603_1608]
R61  0R  [RES 0603_1608]
R62  2K  [RES 0603_1608]
R63  300R  [RES 0603_1608]
R64  1K  [RES 0603_1608]
R65  10K  [RES 0603_1608]
TP5  Test Point  [TPSMD_S1]  (value not drawn)
TP6  Test Point  [TPSMD_S1]  (value not drawn)

### Ports
DISP_CS (in), DISP_DC (in), DISP_IRQ (out), DISP_RST (in), SPI_MISO (out), SPI_MOSI (in), SPI_SCK (in)

### Nets
GND: C21.1 C22.1 C24.2 C25.1 C26.2 C31.1 C61.1 C62.1 C63.1 C64.1 C65.1 C66.1 C67.1 D9.1(K) P6.17 Q9.2(S) R35.1 R36.2 R61.2 R65.1
V3.3: Q8.4(S) R62.1
V3.3D: C26.1 C31.2 C68.1 L7.2 P6.15 P6.16 Q8.1(D) Q8.2(D) Q8.5(D) Q8.6(D)
BS: P6.8 R61.1
DISP_CS: P6.12 ; port DISP_CS
DISP_DC: P6.11 ; port DISP_DC
DISP_IRQ: P6.9 ; port DISP_IRQ
MOSI_1: P6.14 ; port SPI_MOSI
PREVGH: C25.2 C64.2 D11.1(K) P6.21
PREVGL: C24.1 C66.2 D10.2(A) P6.23
RST: P6.10 R64.1 ; port DISP_RST
SCK_1: P6.13 ; port SPI_SCK
NetC21_2: C21.2 P6.4
NetC22_2: C22.2 P6.5
NetC23_1: C23.1 D9.2(A) D10.1(K)
NetC23_2: C23.2 D11.2(A) L7.1 Q2.3(D)
NetC61_2: C61.2 P6.18
NetC62_2: C62.2 P6.19
NetC63_2: C63.2 P6.20
NetC65_2: C65.2 P6.22
NetC67_2: C67.2 P6.24
NetC68_2: C68.2 Q8.3(G) R62.2 R63.2
NetP6_2: P6.2 Q2.1(G) R36.1
NetP6_3: P6.3 Q2.2(S) R35.2
NetP6_6: P6.6 TP5.1(TP)
NetP6_7: P6.7 TP6.1(TP)
NetQ9_1: Q9.1(G) R64.2 R65.2
NetQ9_3: Q9.3(D) R63.1

Not connected (* = marked no-connect by the designer): P6 1 25(GND) 26(GND)

### Notes on the sheet
- Title
- Size:
- Date:
- A4
- Number:
- Time:
- Revision:
- Sheet
- of
- File:

### Library data of the parts
C21 C22 C25 C31 C61-C66 = Capacitor: as C44 on sheet rfid_reader; Value: 1uF; Link: https://www.mouser.com/ProductDetail/Murata-Electronics/GRT188R61H105KE13D?qs=drgMNd%252BkGPNIxxtJByMGCg%3D%3D
C23 C24 = Capacitor: SMT Capacitor; MF: Murata; MP: GRM188C81E475KE11J; Value: 4.7uF; Link: https://www.mouser.com/ProductDetail/Murata-Electronics/GRM188C81E475KE11J?qs=hNud%2FORuBR1v9UuS6Q2ZVQ%3D%3D
C26 = Capacitor: as C10 on sheet buck_boost_converter; Value: 10uF; Link: https://www.mouser.com/ProductDetail/Murata-Electronics/GRM188R61C106MAALD?qs=hNud%2FORuBR3LEOKZ4RJp9w%3D%3D
C67 = Capacitor: SMT Capacitor; MF: Samsung; MP: CL10B474KA8NFNC; Value: 0.47uF; Link: https://www.mouser.com/ProductDetail/Samsung-Electro-Mechanics/CL10B474KA8NFNC?qs=MLItCLRbWszycm%2Fr6tUZRw%3D%3D
C68 = Capacitor: as C13 on sheet buck_boost_converter; Value: 10nF; Link: https://www.mouser.com/ProductDetail/Murata-Electronics/GRM1885C1E103JA01D?qs=ui%252B2d9lVEI4mHR%2FJ9wCzmw%3D%3D
D9-D11 = Schottky Diode: as D3 on sheet battery_charger; ComponentLink1Description: Manufacturer URL; ComponentLink2Description: Datasheet; ComponentLink3URL: http://www.vishay.com/docs/88746/ss12.pdf; ComponentLink3Description: Package Specification; ComponentLink1URL: http://www.vishay.com/; ComponentLink2URL: http://www.vishay.com/docs/88746/ss12.pdf; Value: *; Link: https://www.mouser.com/ProductDetail/Toshiba/CUHS20F30H3F?qs=PqoDHHvF6497%2FIoWy79A3w%3D%3D
L7 = Inductor_sm: Fixed Inductors 2.2uH 20% High Temp AEC-Q200; MF: Murata; MP: DFE252012F-100M=P2; Value: 10uH; Link: https://www.mouser.com/ProductDetail/Murata-Electronics/DFE252012F-100M%3dP2?qs=ty6qhqyUUEuRek9wjqhclw%3D%3D
P6 = Header 24H: Header, 24-Pin, Right Angle; MF: Amphenol; MP: 10051922-2410EHLF; Value: 24 FPC 0.5mm; LatestRevisionDate: 17-Jul-2002; LatestRevisionNote: Re-released for DXP Platform.; Publisher: Altium Limited
Q2 Q9 = Mosfet-N: as Q4 on sheet buck_boost_converter; ComponentLink1Description: Manufacturer URL; ComponentLink2Description: Datasheet; ComponentLink3Description: Package Specification; ComponentLink3URL: http://www.nxp.com/documents/outline_drawing/sot023_po.pdf; ComponentLink1URL: http://www.nxp.com/; ComponentLink2URL: http://www.nxp.com/documents/data_sheet/BSH103.pdf; PackageReference: SOT23; Channel Type: N; Code_JEDEC: TO-236AB; Mounting Technology: Surface Mount; PackageDescription: 3-Pin Small Outline Transistor Package, Body 2.9 x 1.3 mm, Pitch 0.95 mm; PackageVersion: 06-03-16, 03/2006; Value: N Mosfet; Link: https://www.mouser.com/ProductDetail/Diodes-Incorporated/DMN2053U-7?qs=y6ZabgHbY%252BwZqQYPRB57iA%3D%3D
Q8 = Mosfet-P-6_ESD: as Q7 on sheet battery_charger; Value: P Mosfet; Link: https://www.mouser.com/ProductDetail/Vishay-Semiconductors/SI3421DV-T1-GE3?qs=dpt6vIvaxwjvmZPXyyVpRg%3D%3D
R35 = Resistor: SMT Resistor; MF: Panasonic; MP: ERJ-3RQFR47V; Value: 0.47R; Link: https://www.mouser.com/ProductDetail/Panasonic/ERJ-3RQFR47V?qs=4WZYzuGhm5rszJHZ1WW1RA%3D%3D
R36 R65 = Resistor: as R10 on sheet battery_charger; Value: 10K; Link: https://www.mouser.com/ProductDetail/YAGEO/AC0603FR-0710KL?qs=UoPT7wUmgYKz3zh0UDMA4Q%3D%3D
R61 = Resistor: as R8 on sheet battery_charger; Value: 0R; Link: https://www.mouser.com/ProductDetail/YAGEO/AC0603FR-070RL?qs=UoPT7wUmgYIHE8YhvUntLg%3D%3D
R62 = Resistor: as R7 on sheet battery_charger; Value: 2K; Link: https://www.mouser.com/ProductDetail/YAGEO/AC0603FR-072KL?qs=ygRr%2FtkhtesLR2bjSRHyag%3D%3D
R63 = Resistor: as R6 on sheet battery_charger; Value: 300R; Link: https://www.mouser.com/ProductDetail/YAGEO/AC0603FR-07300RL?qs=yhV1fb9g%2FKYRCKndxB9juA%3D%3D
R64 = Resistor: as R40 on sheet buck_boost_converter; Value: 1K; Link: https://www.mouser.com/ProductDetail/YAGEO/AC0603FR-071KL?qs=UoPT7wUmgYJx4gI0q%252BcIRQ%3D%3D
TP5 TP6 = Test Point: Link: https://